# EAGLE schematic RastoBot-r1 (EAGLE 9.6.2)

## Sheet 1 of 11: Inputs
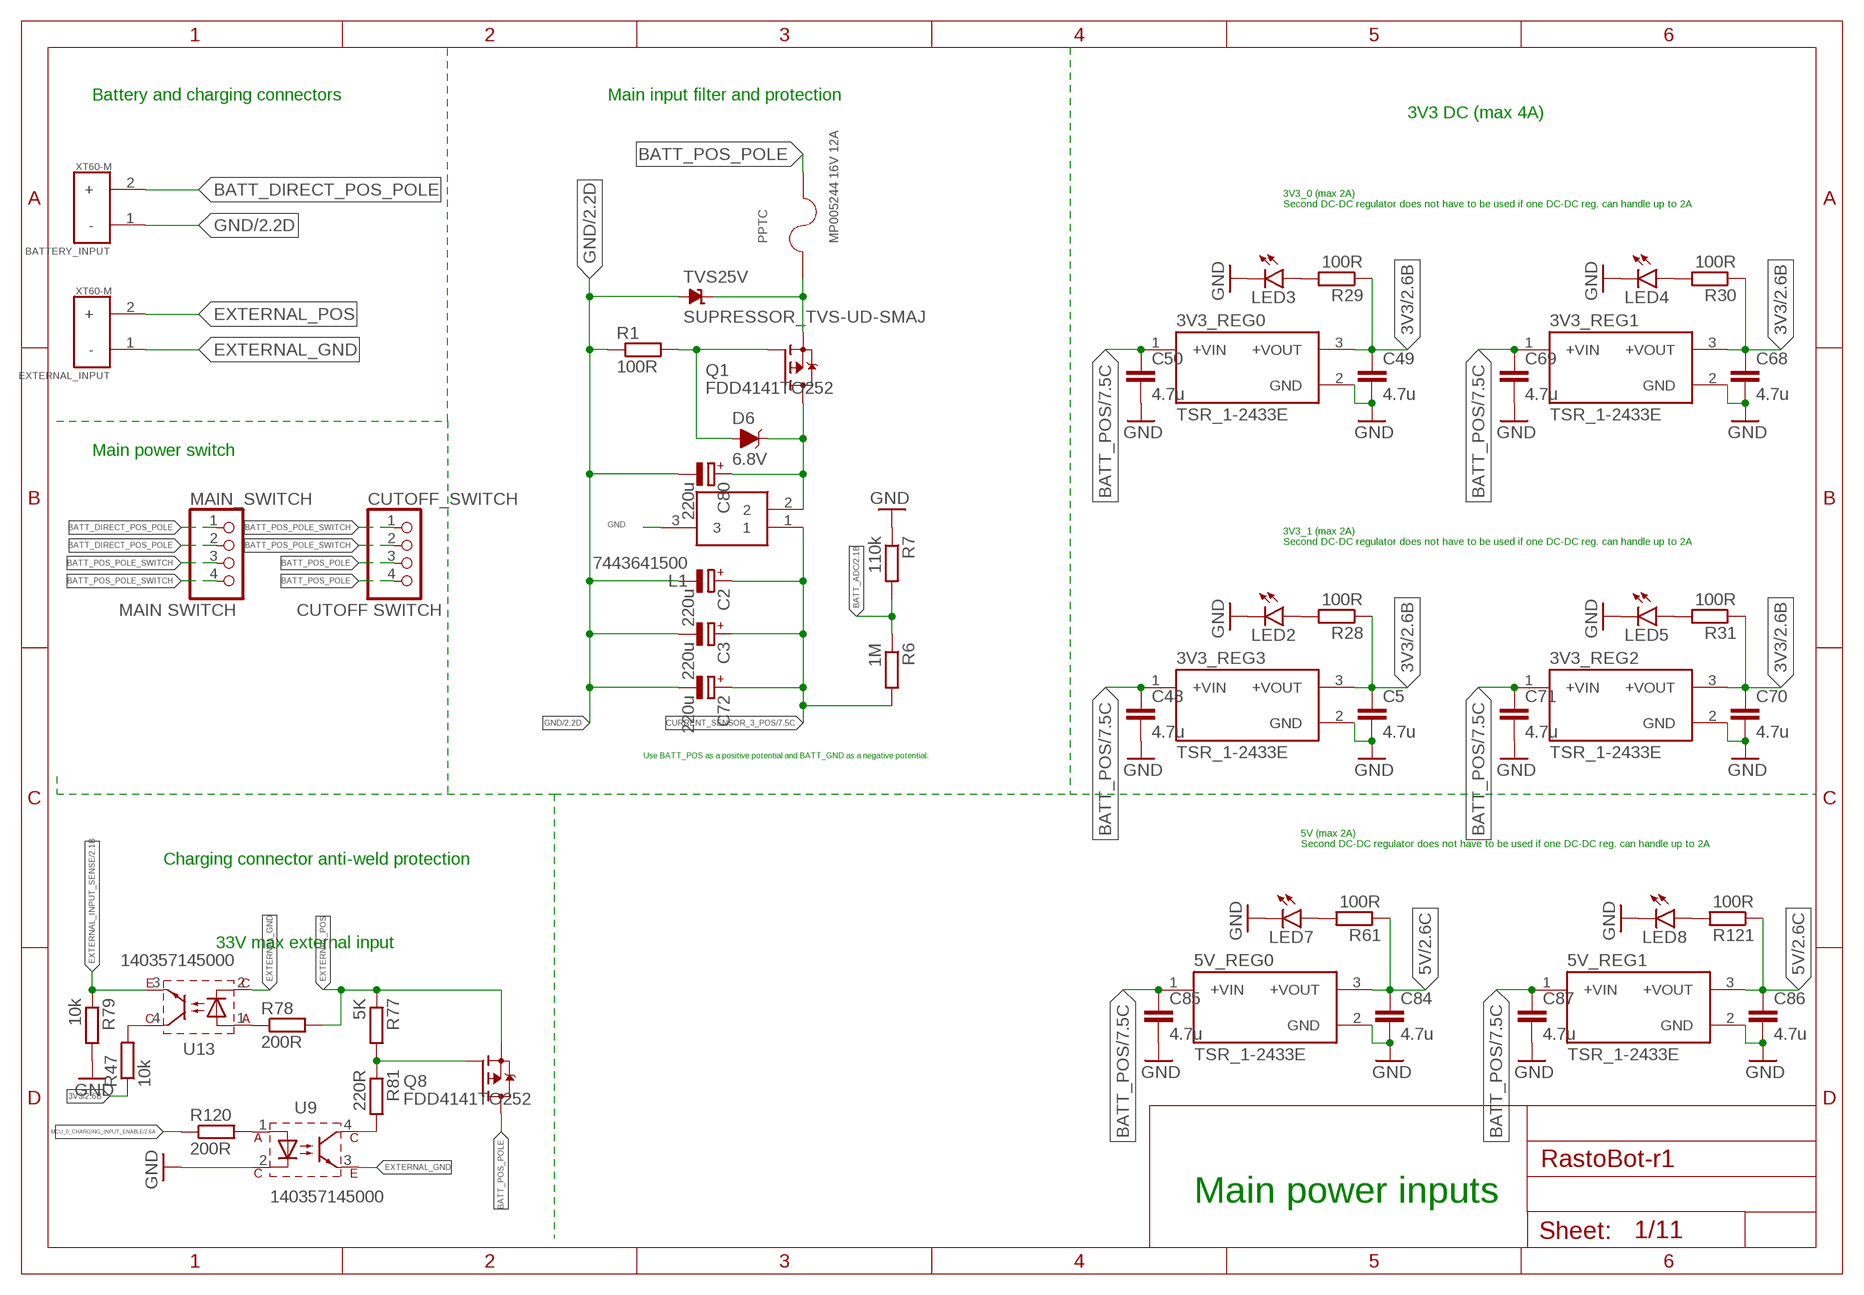
[diagram p0: schematic, sheet 1]

### Parts
3V3_REG0  TSR_1-2433E  [CONV_TSR_1-2433E]
3V3_REG1  TSR_1-2433E  [CONV_TSR_1-2433E]
3V3_REG2  TSR_1-2433E  [CONV_TSR_1-2433E]
3V3_REG3  TSR_1-2433E  [CONV_TSR_1-2433E]
5V_REG0  TSR_1-2433E  [CONV_TSR_1-2433E]
5V_REG1  TSR_1-2433E  [CONV_TSR_1-2433E]
BATTERY_INPUT  XT60-M  [AMASS_XT60-M]
C2  220u  CPOL-EUE2.5-5  [E2,5-5]
C3  220u  CPOL-EUE2.5-5  [E2,5-5]
C5  4.7u  C-EUC1206  [C1206]
C48  4.7u  C-EUC1206  [C1206]
C49  4.7u  C-EUC1206  [C1206]
C50  4.7u  C-EUC1206  [C1206]
C68  4.7u  C-EUC1206  [C1206]
C69  4.7u  C-EUC1206  [C1206]
C70  4.7u  C-EUC1206  [C1206]
C71  4.7u  C-EUC1206  [C1206]
C72  220u  CPOL-EUE2.5-5  [E2,5-5]
C80  220u  CPOL-EUE2.5-5  [E2,5-5]
C84  4.7u  C-EUC1206  [C1206]
C85  4.7u  C-EUC1206  [C1206]
C86  4.7u  C-EUC1206  [C1206]
C87  4.7u  C-EUC1206  [C1206]
CUTOFF_SWITCH  CUTOFF SWITCH  PINHD-1X4  [1X04]
D6  6.8V  DIODE-ZENER-BZT52C3V6S  [SOD-323]
EXTERNAL_INPUT  XT60-M  [AMASS_XT60-M]
L1  7443641500  [74436413300]
LED2  LEDSML0805  [SML0805]
LED3  LEDSML0805  [SML0805]
LED4  LEDSML0805  [SML0805]
LED5  LEDSML0805  [SML0805]
LED7  LEDSML0805  [SML0805]
LED8  LEDSML0805  [SML0805]
MAIN_SWITCH  MAIN SWITCH  PINHD-1X4  [1X04]
PPTC  MP005244 16V 12A  0ZCF0075AF2C  [FUSE_0ZCF0075AF2C]
Q1  FDD4141TO252  [TO252]
Q8  FDD4141TO252  [TO252]
R1  100R  R-EU_R0805  [R0805]
R6  1M  R-EU_R0805  [R0805]
R7  110k  R-EU_R0805  [R0805]
R28  100R  R-EU_R0603  [R0603]
R29  100R  R-EU_R0603  [R0603]
R30  100R  R-EU_R0603  [R0603]
R31  100R  R-EU_R0603  [R0603]
R47  10k  R-EU_R0805  [R0805]
R61  100R  R-EU_R0603  [R0603]
R77  5K  R-EU_R0805  [R0805]
R78  200R  R-EU_R0805  [R0805]
R79  10k  R-EU_R0805  [R0805]
R81  220R  R-EU_R0805  [R0805]
R120  200R  R-EU_R0805  [R0805]
R121  100R  R-EU_R0603  [R0603]
TVS25V  SUPRESSOR_TVS-UD-SMAJ  [SUPRESSOR_SMAJ]
U9  140357145000  WL-OCPT_SERIES_357_140357145000  [WL-OCPT_SOP4]
U13  140357145000  WL-OCPT_SERIES_357_140357145000  [WL-OCPT_SOP4]

### Nets
3V3: 3V3_REG0.3(+VOUT) 3V3_REG1.3(+VOUT) 3V3_REG2.3(+VOUT) 3V3_REG3.3(+VOUT) C5.1 C49.1 C68.1 C70.1 R28.1 R29.1 R30.1 R31.1 R47.1 ; also sheet 2,3,4,5,6,7,8,10,11
5V: 5V_REG0.3(+VOUT) 5V_REG1.3(+VOUT) C84.1 C86.1 R61.1 R121.1 ; also sheet 2,5,10,11
BATT_ADC: R6.1 R7.2 ; also sheet 2
BATT_DIRECT_POS_POLE: BATTERY_INPUT.2(+) MAIN_SWITCH.1 MAIN_SWITCH.2 ; also sheet 11
BATT_POS: 3V3_REG0.1(+VIN) 3V3_REG1.1(+VIN) 3V3_REG2.1(+VIN) 3V3_REG3.1(+VIN) 5V_REG0.1(+VIN) 5V_REG1.1(+VIN) C48.1 C50.1 C69.1 C71.1 C85.1 C87.1 ; also sheet 7,8,9,10,11
BATT_POS_POLE: CUTOFF_SWITCH.3 CUTOFF_SWITCH.4 PPTC.2 Q8.3(D)
BATT_POS_POLE_SWITCH: CUTOFF_SWITCH.1 CUTOFF_SWITCH.2 MAIN_SWITCH.3 MAIN_SWITCH.4
CURRENT_SENSOR_3_POS: C2.+ C3.+ C72.+ L1.1 R6.2 ; also sheet 7
EXTERNAL_GND: EXTERNAL_INPUT.1(-) U9.3 U13.2
EXTERNAL_INPUT_SENSE: R79.1 U13.3 ; also sheet 2
EXTERNAL_POS: EXTERNAL_INPUT.2(+) Q8.2(S) R77.1 R78.2
GND: 3V3_REG0.2(GND) 3V3_REG1.2(GND) 3V3_REG2.2(GND) 3V3_REG3.2(GND) 5V_REG0.2(GND) 5V_REG1.2(GND) BATTERY_INPUT.1(-) C2.- C3.- C5.2 C48.2 C49.2 C50.2 C68.2 C69.2 C70.2 C71.2 C72.- C80.- C84.2 C85.2 C86.2 C87.2 L1.3 LED2.C LED3.C LED4.C LED5.C LED7.C LED8.C R1.1 R7.1 R79.2 TVS25V.A U9.2 ; also sheet 2,3,4,5,6,7,8,9,10
MCU_0_CHARGING_INPUT_ENABLE: R120.1 ; also sheet 2
N$1: D6.A Q1.1(G) R1.2
N$2: C80.+ D6.C L1.2 Q1.3(D)
N$3: PPTC.1 Q1.2(S) TVS25V.C
N$30: LED2.A R28.2
N$57: LED3.A R29.2
N$58: LED4.A R30.2
N$59: LED5.A R31.2
N$83: R120.2 U9.1
N$84: Q8.1(G) R77.2 R81.1
N$85: R81.2 U9.4
N$87: R47.2 U13.4
N$120: LED7.A R61.2
N$121: LED8.A R121.2
N$122: R78.1 U13.1

### Notes on the sheet
- Battery and charging connectors | Main input filter and protection
- 3V3 DC (max 4A)
- 3V3_0 (max 2A)
  Second DC-DC regulator does not have to be used if one DC-DC reg. can handle up to 2A
- Main power switch
- 3V3_1 (max 2A)
  Second DC-DC regulator does not have to be used if one DC-DC reg. can handle up to 2A
- Use BATT_POS as a positive potential and BATT_GND as a negative potential.
- 5V (max 2A)
  Second DC-DC regulator does not have to be used if one DC-DC reg. can handle up to 2A
- Charging connector anti-weld protection
- 33V max external input
- Main power inputs

## Sheet 2 of 11: MCU_0 PIC18 Sensors
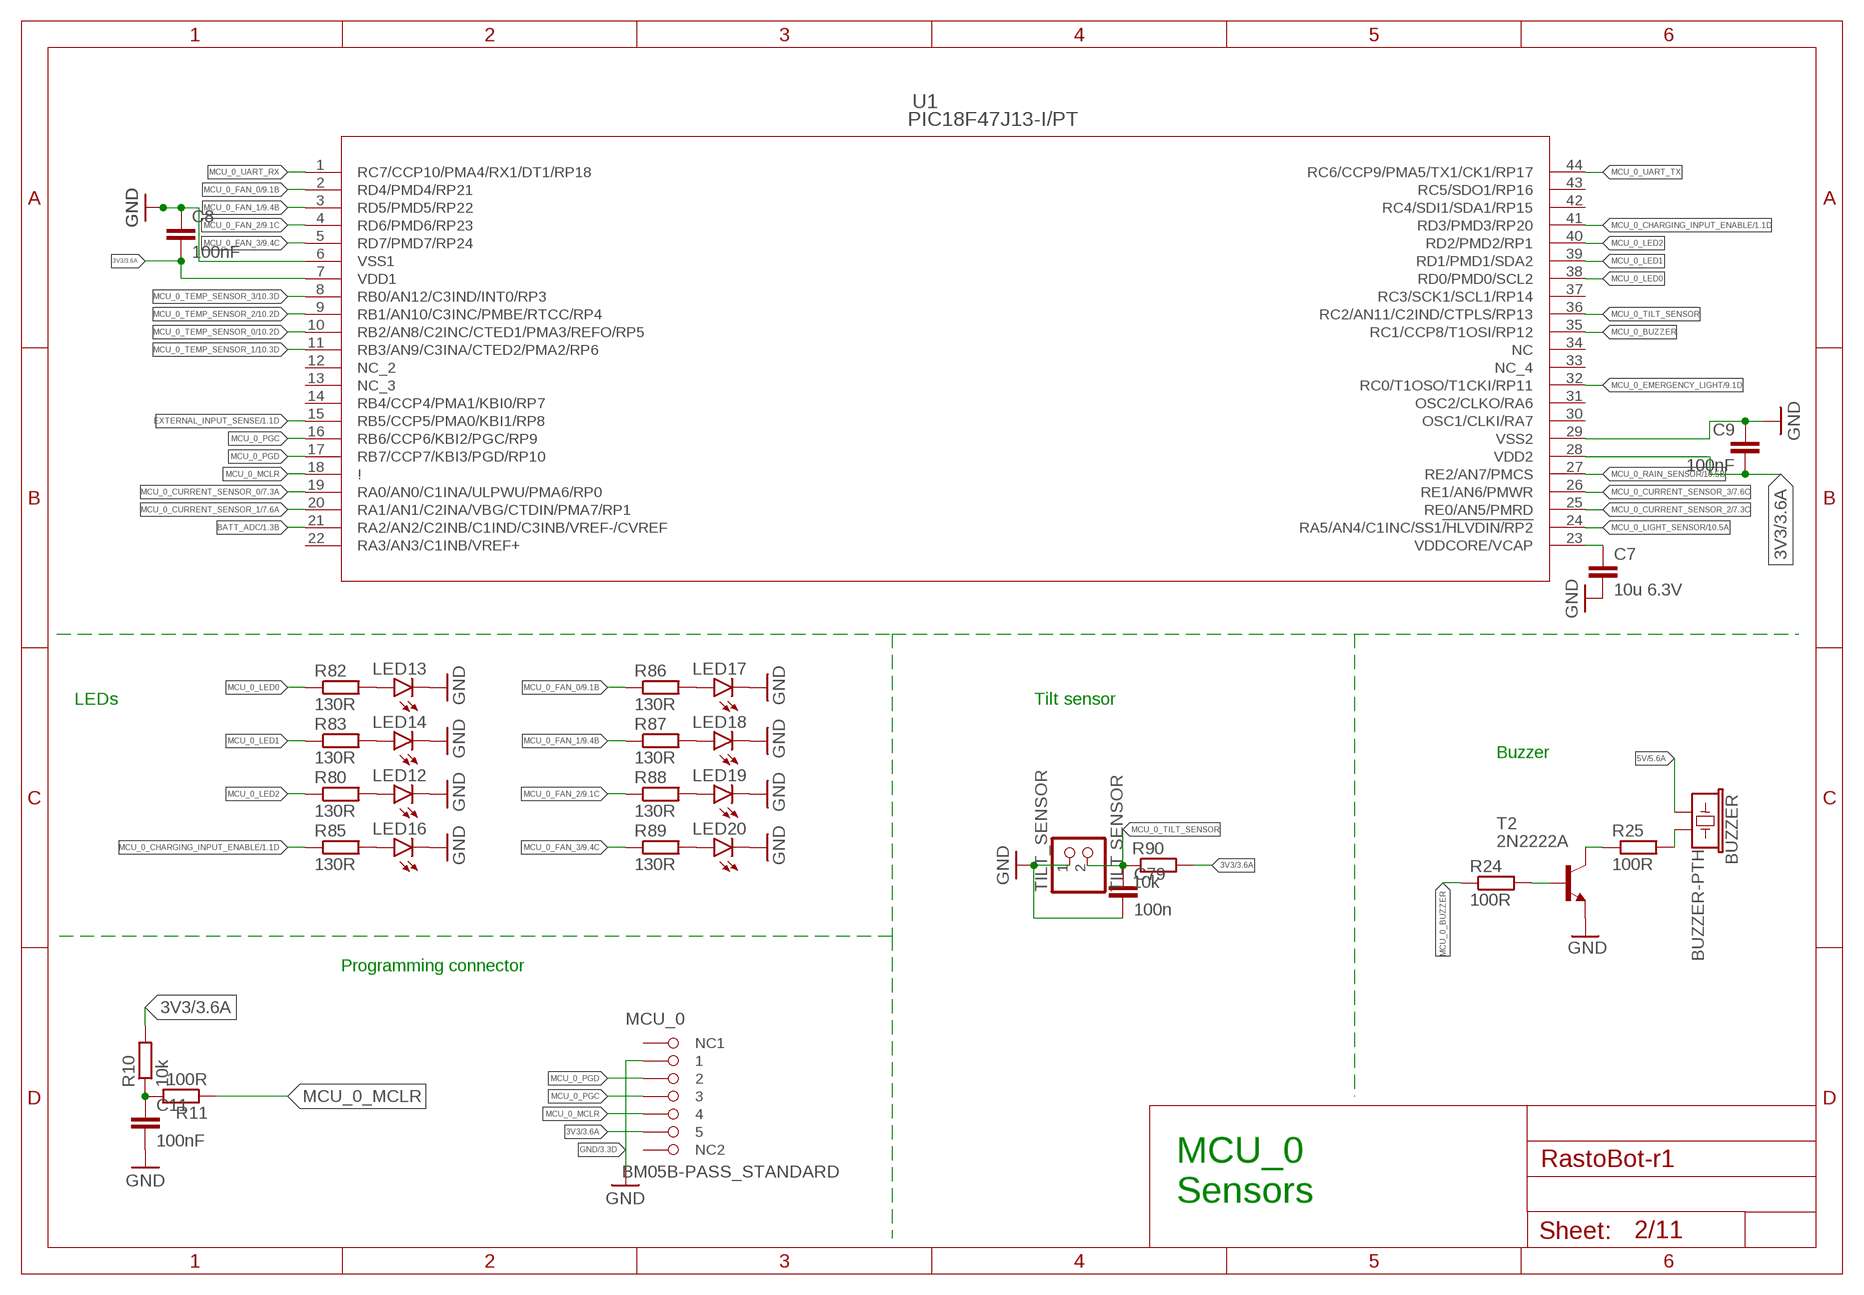
[diagram p1: schematic, sheet 2]

### Parts
BUZZER  BUZZER-PTH  [BUZZER-12MM]
C7  10u 6.3V  C-EUC1206  [C1206]
C8  100nF  C-EUC0603  [C0603]
C9  100nF  C-EUC0603  [C0603]
C11  100nF  C-EUC0603  [C0603]
C79  100n  C-EUC1206  [C1206]
LED12  LEDSML0805  [SML0805]
LED13  LEDSML0805  [SML0805]
LED14  LEDSML0805  [SML0805]
LED16  LEDSML0805  [SML0805]
LED17  LEDSML0805  [SML0805]
LED18  LEDSML0805  [SML0805]
LED19  LEDSML0805  [SML0805]
LED20  LEDSML0805  [SML0805]
MCU_0  BM05B-PASS_STANDARD  [BM05B-PASS]
R10  10k  R-EU_R0805  [R0805]
R11  100R  R-EU_R0805  [R0805]
R24  100R  R-EU_R0805  [R0805]
R25  100R  R-EU_R0805  [R0805]
R80  130R  R-EU_R0603  [R0603]
R82  130R  R-EU_R0603  [R0603]
R83  130R  R-EU_R0603  [R0603]
R85  130R  R-EU_R0603  [R0603]
R86  130R  R-EU_R0603  [R0603]
R87  130R  R-EU_R0603  [R0603]
R88  130R  R-EU_R0603  [R0603]
R89  130R  R-EU_R0603  [R0603]
R90  10k  R-EU_R0603  [R0603]
T2  2N2222A  BC547-NPN-TO92-CBE  [TO92-CBE]
TILT_SENSOR  TILT SENSOR  PINHD-1X2  [1X02]
U1  PIC18F47J13-I/PT  [TQFP44_10X10MC_MCH]

### Nets
3V3: C8.2 C9.2 MCU_0.P$5 R10.2 R90.2 U1.7(VDD1) U1.28(VDD2) ; also sheet 1,3,4,5,6,7,8,10,11
5V: BUZZER.+ ; also sheet 1,5,10,11
BATT_ADC: U1.21(RA2/AN2/C2INB/C1IND/C3INB/VREF-/CVREF) ; also sheet 1
EXTERNAL_INPUT_SENSE: U1.15(RB5/CCP5/PMA0/KBI1/RP8) ; also sheet 1
GND: C7.2 C8.1 C9.1 C11.2 C79.2 LED12.C LED13.C LED14.C LED16.C LED17.C LED18.C LED19.C LED20.C MCU_0.P$1 T2.E TILT_SENSOR.1 U1.6(VSS1) U1.29(VSS2) ; also sheet 1,3,4,5,6,7,8,9,10
MCU_0_BUZZER: R24.1 U1.35(RC1/CCP8/T1OSI/RP12)
MCU_0_CHARGING_INPUT_ENABLE: R85.1 U1.41(RD3/PMD3/RP20) ; also sheet 1
MCU_0_CURRENT_SENSOR_0: U1.19(RA0/AN0/C1INA/ULPWU/PMA6/RP0) ; also sheet 7,11
MCU_0_CURRENT_SENSOR_1: U1.20(RA1/AN1/C2INA/VBG/CTDIN/PMA7/RP1) ; also sheet 7,11
MCU_0_CURRENT_SENSOR_2: U1.25(RE0/AN5/PMRD) ; also sheet 7,11
MCU_0_CURRENT_SENSOR_3: U1.26(RE1/AN6/PMWR) ; also sheet 7,11
MCU_0_EMERGENCY_LIGHT: U1.32(RC0/T1OSO/T1CKI/RP11) ; also sheet 9
MCU_0_FAN_0: R86.1 U1.2(RD4/PMD4/RP21) ; also sheet 9
MCU_0_FAN_1: R87.1 U1.3(RD5/PMD5/RP22) ; also sheet 9
MCU_0_FAN_2: R88.1 U1.4(RD6/PMD6/RP23) ; also sheet 9
MCU_0_FAN_3: R89.1 U1.5(RD7/PMD7/RP24) ; also sheet 9
MCU_0_LED0: R82.1 U1.38(RD0/PMD0/SCL2)
MCU_0_LED1: R83.1 U1.39(RD1/PMD1/SDA2)
MCU_0_LED2: R80.1 U1.40(RD2/PMD2/RP1)
MCU_0_LIGHT_SENSOR: U1.24(RA5/AN4/C1INC/SS1!/HLVDIN/RP2) ; also sheet 10
MCU_0_MCLR: MCU_0.P$4 R11.1 U1.18(!)
MCU_0_PGC: MCU_0.P$3 U1.16(RB6/CCP6/KBI2/PGC/RP9)
MCU_0_PGD: MCU_0.P$2 U1.17(RB7/CCP7/KBI3/PGD/RP10)
MCU_0_RAIN_SENSOR: U1.27(RE2/AN7/PMCS) ; also sheet 10
MCU_0_TEMP_SENSOR_0: U1.10(RB2/AN8/C2INC/CTED1/PMA3/REFO/RP5) ; also sheet 10
MCU_0_TEMP_SENSOR_1: U1.11(RB3/AN9/C3INA/CTED2/PMA2/RP6) ; also sheet 10
MCU_0_TEMP_SENSOR_2: U1.9(RB1/AN10/C3INC/PMBE/RTCC/RP4) ; also sheet 10
MCU_0_TEMP_SENSOR_3: U1.8(RB0/AN12/C3IND/INT0/RP3) ; also sheet 10
MCU_0_TILT_SENSOR: C79.1 R90.1 TILT_SENSOR.2 U1.36(RC2/AN11/C2IND/CTPLS/RP13) ; also sheet 11
MCU_0_UART_RX: U1.1(RC7/CCP10/PMA4/RX1/DT1/RP18) ; also sheet 4,11
MCU_0_UART_TX: U1.44(RC6/CCP9/PMA5/TX1/CK1/RP17) ; also sheet 4,11
N$11: C7.1 U1.23(VDDCORE/VCAP)
N$14: C11.1 R10.1 R11.2
N$24: R24.2 T2.B
N$28: BUZZER.- R25.2
N$61: R25.1 T2.C
N$88: LED12.A R80.2
N$89: LED13.A R82.2
N$90: LED14.A R83.2
N$92: LED16.A R85.2
N$93: LED17.A R86.2
N$94: LED18.A R87.2
N$95: LED19.A R88.2
N$96: LED20.A R89.2
Unconnected: MCU_0.A(NC1) MCU_0.B(NC2) U1.12(NC_2) U1.13(NC_3) U1.14(RB4/CCP4/PMA1/KBI0/RP7) U1.22(RA3/AN3/C1INB/VREF+) U1.30(OSC1/CLKI/RA7) U1.31(OSC2/CLKO/RA6) U1.33(NC_4) U1.34(NC) U1.37(RC3/SCK1/SCL1/RP14) U1.42(RC4/SDI1/SDA1/RP15) U1.43(RC5/SDO1/RP16)

### Notes on the sheet
- LEDs | Tilt sensor
- Buzzer
- Programming connector
- MCU_0
  Sensors

## Sheet 3 of 11: MCU_1 PIC32MM Motor Driving
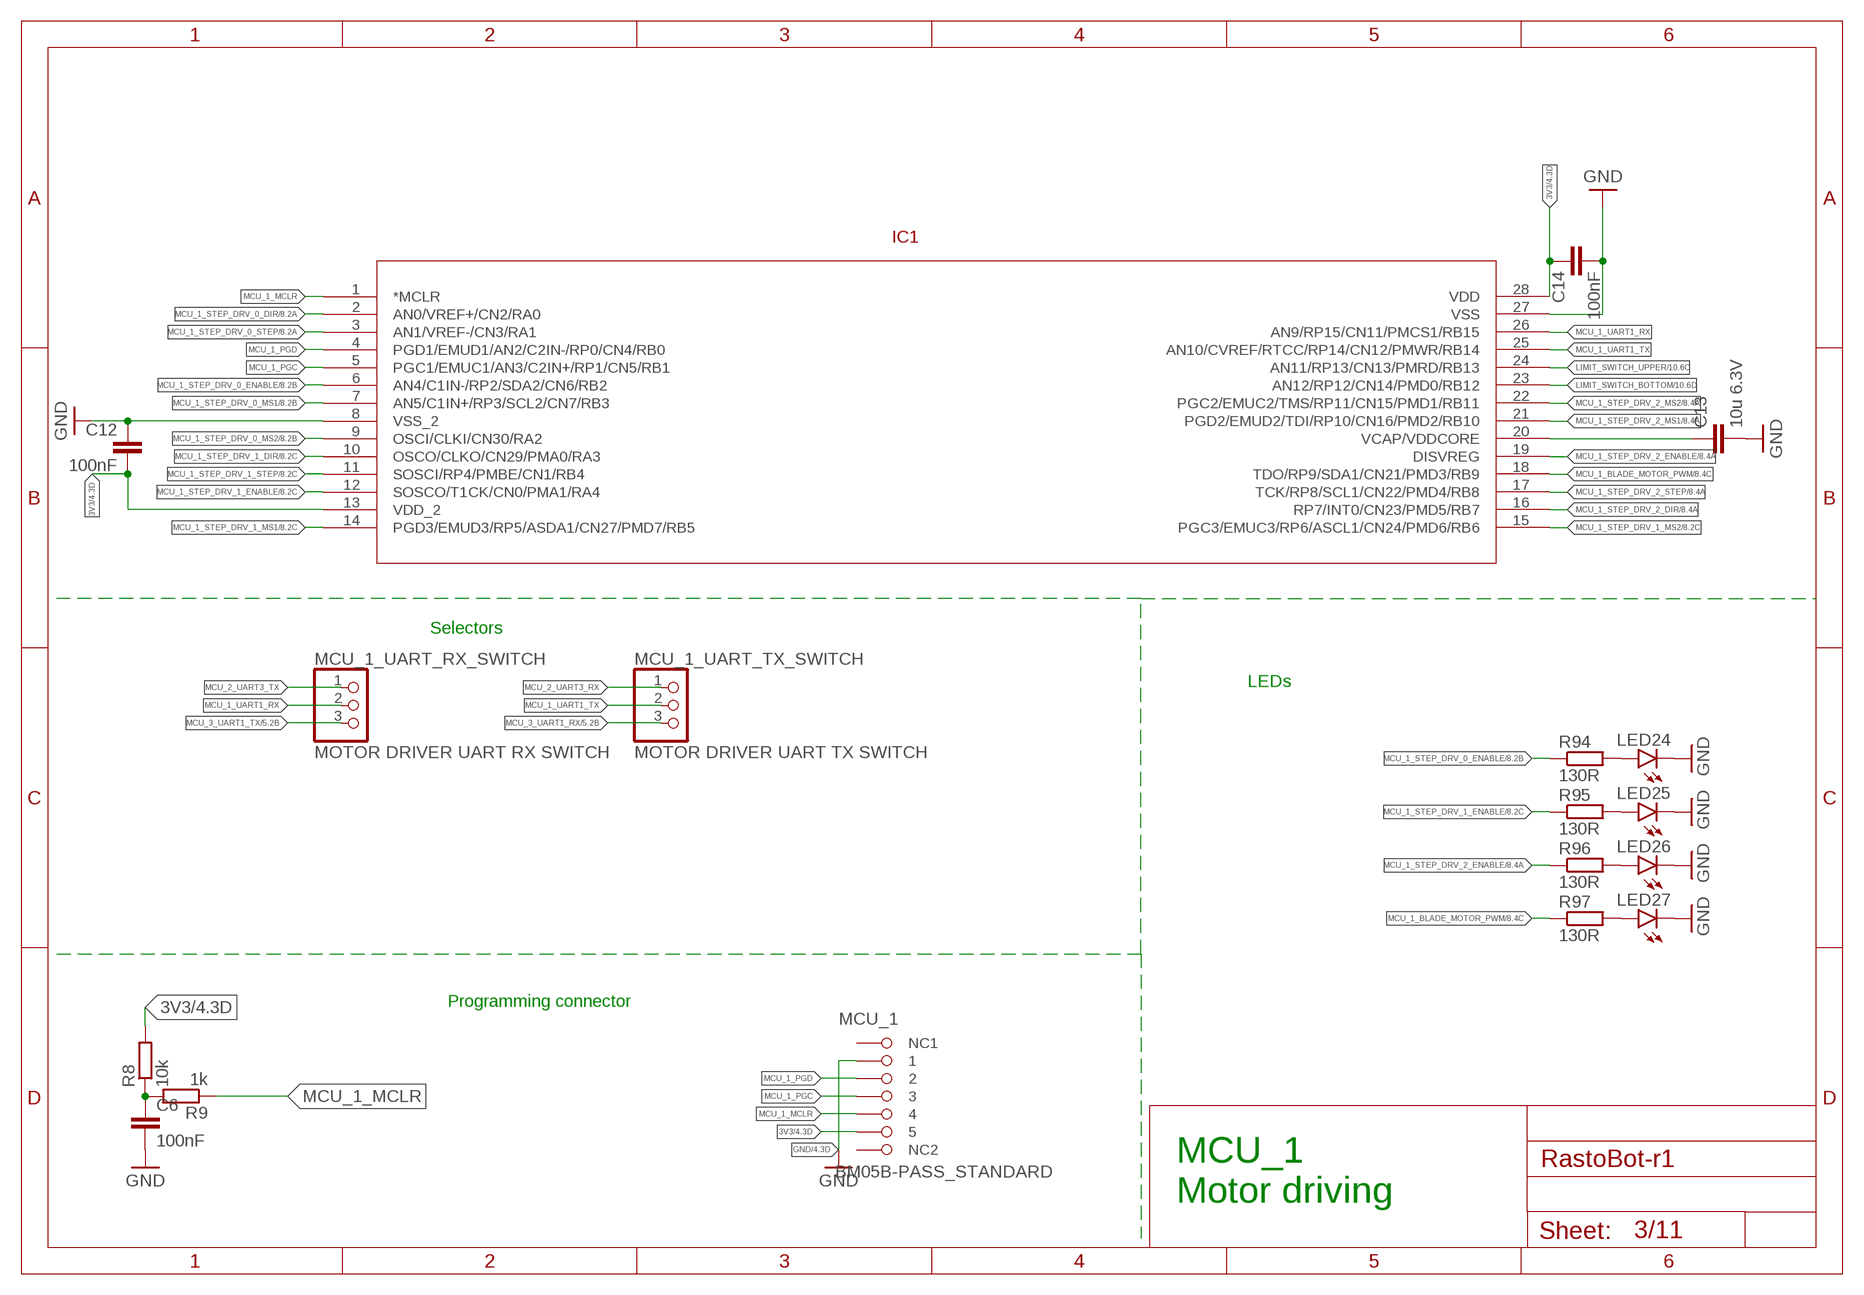
[diagram p2: schematic, sheet 3]

### Parts
C6  100nF  C-EUC0603  [C0603]
C12  100nF  C-EUC0603  [C0603]
C13  10u 6.3V  C-EUC1206  [C1206]
C14  100nF  C-EUC0603  [C0603]
IC1  PIC24FJ32GA002-X  [SPDIP28_300MC]
LED24  LEDSML0805  [SML0805]
LED25  LEDSML0805  [SML0805]
LED26  LEDSML0805  [SML0805]
LED27  LEDSML0805  [SML0805]
MCU_1  BM05B-PASS_STANDARD  [BM05B-PASS]
MCU_1_UART_RX_SWITCH  MOTOR DRIVER UART RX SWITCH  PINHD-1X3  [1X03]
MCU_1_UART_TX_SWITCH  MOTOR DRIVER UART TX SWITCH  PINHD-1X3  [1X03]
R8  10k  R-EU_R0805  [R0805]
R9  1k  R-EU_R0805  [R0805]
R94  130R  R-EU_R0603  [R0603]
R95  130R  R-EU_R0603  [R0603]
R96  130R  R-EU_R0603  [R0603]
R97  130R  R-EU_R0603  [R0603]

### Nets
3V3: C12.2 C14.1 IC1.13(VDD_2) IC1.28(VDD) MCU_1.P$5 R8.2 ; also sheet 1,2,4,5,6,7,8,10,11
GND: C6.2 C12.1 C13.2 C14.2 IC1.8(VSS_2) IC1.27(VSS) LED24.C LED25.C LED26.C LED27.C MCU_1.P$1 ; also sheet 1,2,4,5,6,7,8,9,10
LIMIT_SWITCH_BOTTOM: IC1.23(AN12/RP12/CN14/PMD0/RB12) ; also sheet 10
LIMIT_SWITCH_UPPER: IC1.24(AN11/RP13/CN13/PMRD/RB13) ; also sheet 10
MCU_1_BLADE_MOTOR_PWM: IC1.18(TDO/RP9/SDA1/CN21/PMD3/RB9) R97.1 ; also sheet 8
MCU_1_MCLR: IC1.1(*MCLR) MCU_1.P$4 R9.1
MCU_1_PGC: IC1.5(PGC1/EMUC1/AN3/C2IN+/RP1/CN5/RB1) MCU_1.P$3
MCU_1_PGD: IC1.4(PGD1/EMUD1/AN2/C2IN-/RP0/CN4/RB0) MCU_1.P$2
MCU_1_STEP_DRV_0_DIR: IC1.2(AN0/VREF+/CN2/RA0) ; also sheet 8
MCU_1_STEP_DRV_0_ENABLE: IC1.6(AN4/C1IN-/RP2/SDA2/CN6/RB2) R94.1 ; also sheet 8
MCU_1_STEP_DRV_0_MS1: IC1.7(AN5/C1IN+/RP3/SCL2/CN7/RB3) ; also sheet 8
MCU_1_STEP_DRV_0_MS2: IC1.9(OSCI/CLKI/CN30/RA2) ; also sheet 8
MCU_1_STEP_DRV_0_STEP: IC1.3(AN1/VREF-/CN3/RA1) ; also sheet 8
MCU_1_STEP_DRV_1_DIR: IC1.10(OSCO/CLKO/CN29/PMA0/RA3) ; also sheet 8
MCU_1_STEP_DRV_1_ENABLE: IC1.12(SOSCO/T1CK/CN0/PMA1/RA4) R95.1 ; also sheet 8
MCU_1_STEP_DRV_1_MS1: IC1.14(PGD3/EMUD3/RP5/ASDA1/CN27/PMD7/RB5) ; also sheet 8
MCU_1_STEP_DRV_1_MS2: IC1.15(PGC3/EMUC3/RP6/ASCL1/CN24/PMD6/RB6) ; also sheet 8
MCU_1_STEP_DRV_1_STEP: IC1.11(SOSCI/RP4/PMBE/CN1/RB4) ; also sheet 8
MCU_1_STEP_DRV_2_DIR: IC1.16(RP7/INT0/CN23/PMD5/RB7) ; also sheet 8
MCU_1_STEP_DRV_2_ENABLE: IC1.19(DISVREG) R96.1 ; also sheet 8
MCU_1_STEP_DRV_2_MS1: IC1.21(PGD2/EMUD2/TDI/RP10/CN16/PMD2/RB10) ; also sheet 8
MCU_1_STEP_DRV_2_MS2: IC1.22(PGC2/EMUC2/TMS/RP11/CN15/PMD1/RB11) ; also sheet 8
MCU_1_STEP_DRV_2_STEP: IC1.17(TCK/RP8/SCL1/CN22/PMD4/RB8) ; also sheet 8
MCU_1_UART1_RX: IC1.26(AN9/RP15/CN11/PMCS1/RB15) MCU_1_UART_RX_SWITCH.2 ; also sheet 11
MCU_1_UART1_TX: IC1.25(AN10/CVREF/RTCC/RP14/CN12/PMWR/RB14) MCU_1_UART_TX_SWITCH.2 ; also sheet 11
MCU_2_UART3_RX: MCU_1_UART_TX_SWITCH.1 ; also sheet 4
MCU_2_UART3_TX: MCU_1_UART_RX_SWITCH.1 ; also sheet 4
MCU_3_UART1_RX: MCU_1_UART_TX_SWITCH.3 ; also sheet 5,11
MCU_3_UART1_TX: MCU_1_UART_RX_SWITCH.3 ; also sheet 5,11
N$9: C6.1 R8.1 R9.2
N$10: C13.1 IC1.20(VCAP/VDDCORE)
N$100: LED24.A R94.2
N$101: LED25.A R95.2
N$102: LED26.A R96.2
N$103: LED27.A R97.2
Unconnected: MCU_1.A(NC1) MCU_1.B(NC2)

### Notes on the sheet
- Selectors
- LEDs
- Programming connector
- MCU_1
  Motor driving

## Sheet 4 of 11: MCU_2 PIC32MX Navigation
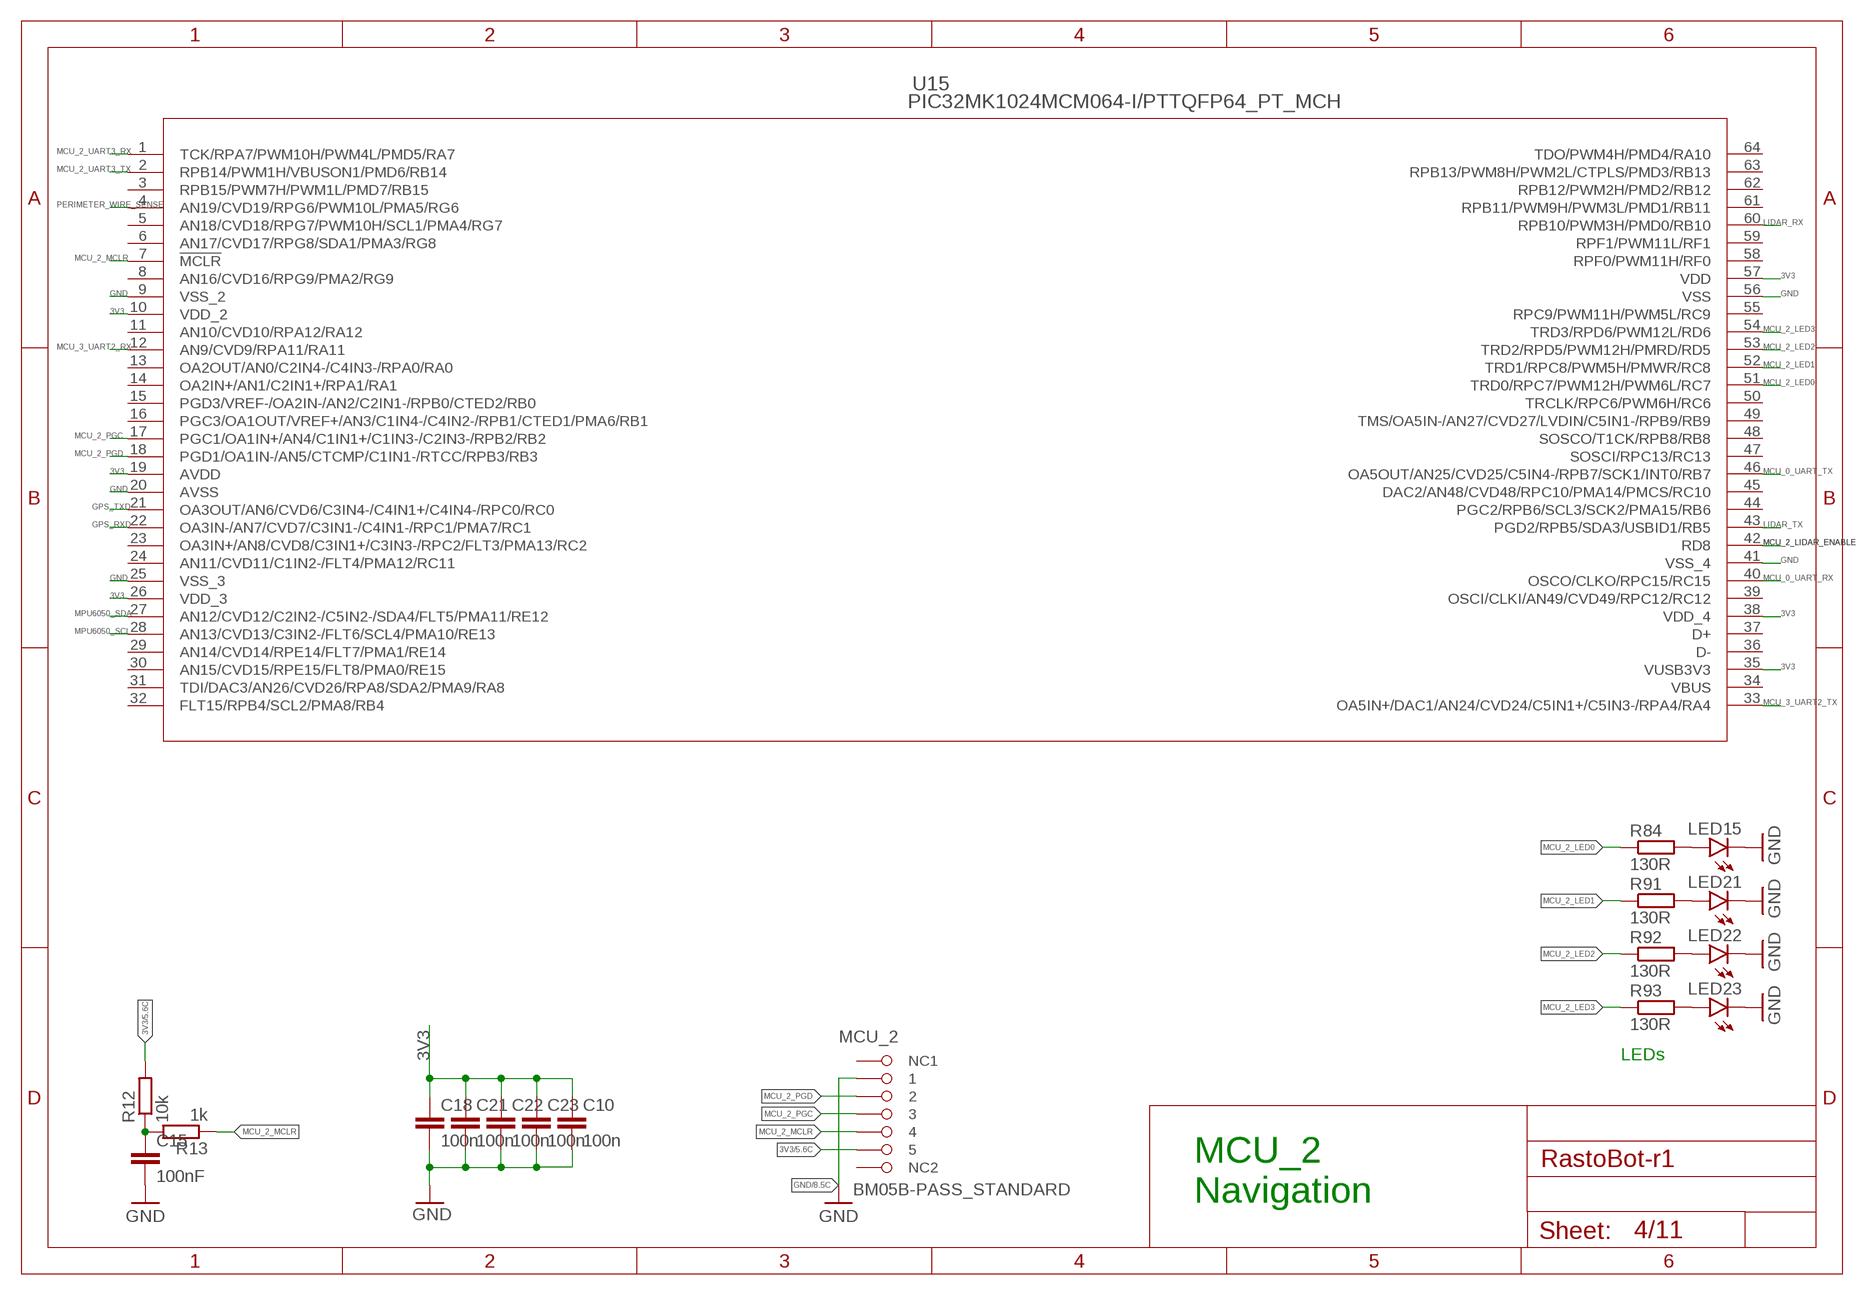
[diagram p3: schematic, sheet 4]

### Parts
C10  100n  C-EUC0603  [C0603]
C15  100nF  C-EUC0603  [C0603]
C18  100n  C-EUC0603  [C0603]
C21  100n  C-EUC0603  [C0603]
C22  100n  C-EUC0603  [C0603]
C23  100n  C-EUC0603  [C0603]
LED15  LEDSML0805  [SML0805]
LED21  LEDSML0805  [SML0805]
LED22  LEDSML0805  [SML0805]
LED23  LEDSML0805  [SML0805]
MCU_2  BM05B-PASS_STANDARD  [BM05B-PASS]
R12  10k  R-EU_R0805  [R0805]
R13  1k  R-EU_R0805  [R0805]
R84  130R  R-EU_R0603  [R0603]
R91  130R  R-EU_R0603  [R0603]
R92  130R  R-EU_R0603  [R0603]
R93  130R  R-EU_R0603  [R0603]
U15  PIC32MK1024MCM064-I/PTTQFP64_PT_MCH  [TQFP64_PT_MCH]

### Nets
3V3: C10.1 C18.1 C21.1 C22.1 C23.1 MCU_2.P$5 R12.2 U15.10(VDD_2) U15.19(AVDD) U15.26(VDD_3) U15.35(VUSB3V3) U15.38(VDD_4) U15.57(VDD) ; also sheet 1,2,3,5,6,7,8,10,11
GND: C10.2 C15.2 C18.2 C21.2 C22.2 C23.2 LED15.C LED21.C LED22.C LED23.C MCU_2.P$1 U15.9(VSS_2) U15.20(AVSS) U15.25(VSS_3) U15.41(VSS_4) U15.56(VSS) ; also sheet 1,2,3,5,6,7,8,9,10
GPS_RXD: U15.22(OA3IN-/AN7/CVD7/C3IN1-/C4IN1-/RPC1/PMA7/RC1) ; also sheet 10,11
GPS_TXD: U15.21(OA3OUT/AN6/CVD6/C3IN4-/C4IN1+/C4IN4-/RPC0/RC0) ; also sheet 10,11
LIDAR_RX: U15.60(RPB10/PWM3H/PMD0/RB10) ; also sheet 10,11
LIDAR_TX: U15.43(PGD2/RPB5/SDA3/USBID1/RB5) ; also sheet 10,11
MCU_0_UART_RX: U15.40(OSCO/CLKO/RPC15/RC15) ; also sheet 2,11
MCU_0_UART_TX: U15.46(OA5OUT/AN25/CVD25/C5IN4-/RPB7/SCK1/INT0/RB7) ; also sheet 2,11
MCU_2_LED0: R84.1 U15.51(TRD0/RPC7/PWM12H/PWM6L/RC7)
MCU_2_LED1: R91.1 U15.52(TRD1/RPC8/PWM5H/PMWR/RC8)
MCU_2_LED2: R92.1 U15.53(TRD2/RPD5/PWM12H/PMRD/RD5)
MCU_2_LED3: R93.1 U15.54(TRD3/RPD6/PWM12L/RD6)
MCU_2_LIDAR_ENABLE: U15.42(RD8) ; also sheet 10
MCU_2_MCLR: MCU_2.P$4 R13.1 U15.7(!MCLR)
MCU_2_PGC: MCU_2.P$3 U15.17(PGC1/OA1IN+/AN4/C1IN1+/C1IN3-/C2IN3-/RPB2/RB2)
MCU_2_PGD: MCU_2.P$2 U15.18(PGD1/OA1IN-/AN5/CTCMP/C1IN1-/RTCC/RPB3/RB3)
MCU_2_UART3_RX: U15.1(TCK/RPA7/PWM10H/PWM4L/PMD5/RA7) ; also sheet 3
MCU_2_UART3_TX: U15.2(RPB14/PWM1H/VBUSON1/PMD6/RB14) ; also sheet 3
MCU_3_UART2_RX: U15.12(AN9/CVD9/RPA11/RA11) ; also sheet 5,10
MCU_3_UART2_TX: U15.33(OA5IN+/DAC1/AN24/CVD24/C5IN1+/C5IN3-/RPA4/RA4) ; also sheet 5,10
MPU6050_SCL: U15.28(AN13/CVD13/C3IN2-/FLT6/SCL4/PMA10/RE13) ; also sheet 6,11
MPU6050_SDA: U15.27(AN12/CVD12/C2IN2-/C5IN2-/SDA4/FLT5/PMA11/RE12) ; also sheet 6,11
N$15: C15.1 R12.1 R13.2
N$91: LED15.A R84.2
N$97: LED21.A R91.2
N$98: LED22.A R92.2
N$99: LED23.A R93.2
PERIMETER_WIRE_SENSE: U15.4(AN19/CVD19/RPG6/PWM10L/PMA5/RG6) ; also sheet 10,11
Unconnected: MCU_2.A(NC1) MCU_2.B(NC2) U15.3(RPB15/PWM7H/PWM1L/PMD7/RB15) U15.5(AN18/CVD18/RPG7/PWM10H/SCL1/PMA4/RG7) U15.6(AN17/CVD17/RPG8/SDA1/PMA3/RG8) U15.8(AN16/CVD16/RPG9/PMA2/RG9) U15.11(AN10/CVD10/RPA12/RA12) U15.13(OA2OUT/AN0/C2IN4-/C4IN3-/RPA0/RA0) U15.14(OA2IN+/AN1/C2IN1+/RPA1/RA1) U15.15(PGD3/VREF-/OA2IN-/AN2/C2IN1-/RPB0/CTED2/RB0) U15.16(PGC3/OA1OUT/VREF+/AN3/C1IN4-/C4IN2-/RPB1/CTED1/PMA6/RB1) U15.23(OA3IN+/AN8/CVD8/C3IN1+/C3IN3-/RPC2/FLT3/PMA13/RC2) U15.24(AN11/CVD11/C1IN2-/FLT4/PMA12/RC11) U15.29(AN14/CVD14/RPE14/FLT7/PMA1/RE14) U15.30(AN15/CVD15/RPE15/FLT8/PMA0/RE15) U15.31(TDI/DAC3/AN26/CVD26/RPA8/SDA2/PMA9/RA8) U15.32(FLT15/RPB4/SCL2/PMA8/RB4) U15.36(D-) U15.37(D+) U15.39(OSCI/CLKI/AN49/CVD49/RPC12/RC12) U15.44(PGC2/RPB6/SCL3/SCK2/PMA15/RB6) U15.45(DAC2/AN48/CVD48/RPC10/PMA14/PMCS/RC10) U15.47(SOSCI/RPC13/RC13) U15.48(SOSCO/T1CK/RPB8/RB8) U15.49(TMS/OA5IN-/AN27/CVD27/LVDIN/C5IN1-/RPB9/RB9) U15.50(TRCLK/RPC6/PWM6H/RC6) U15.55(RPC9/PWM11H/PWM5L/RC9) U15.58(RPF0/PWM11H/RF0) U15.59(RPF1/PWM11L/RF1) U15.61(RPB11/PWM9H/PWM3L/PMD1/RB11) U15.62(RPB12/PWM2H/PMD2/RB12) U15.63(RPB13/PWM8H/PWM2L/CTPLS/PMD3/RB13) U15.64(TDO/PWM4H/PMD4/RA10)

### Notes on the sheet
- LEDs
- MCU_2
  Navigation

## Sheet 5 of 11: MCU_3 ESP32
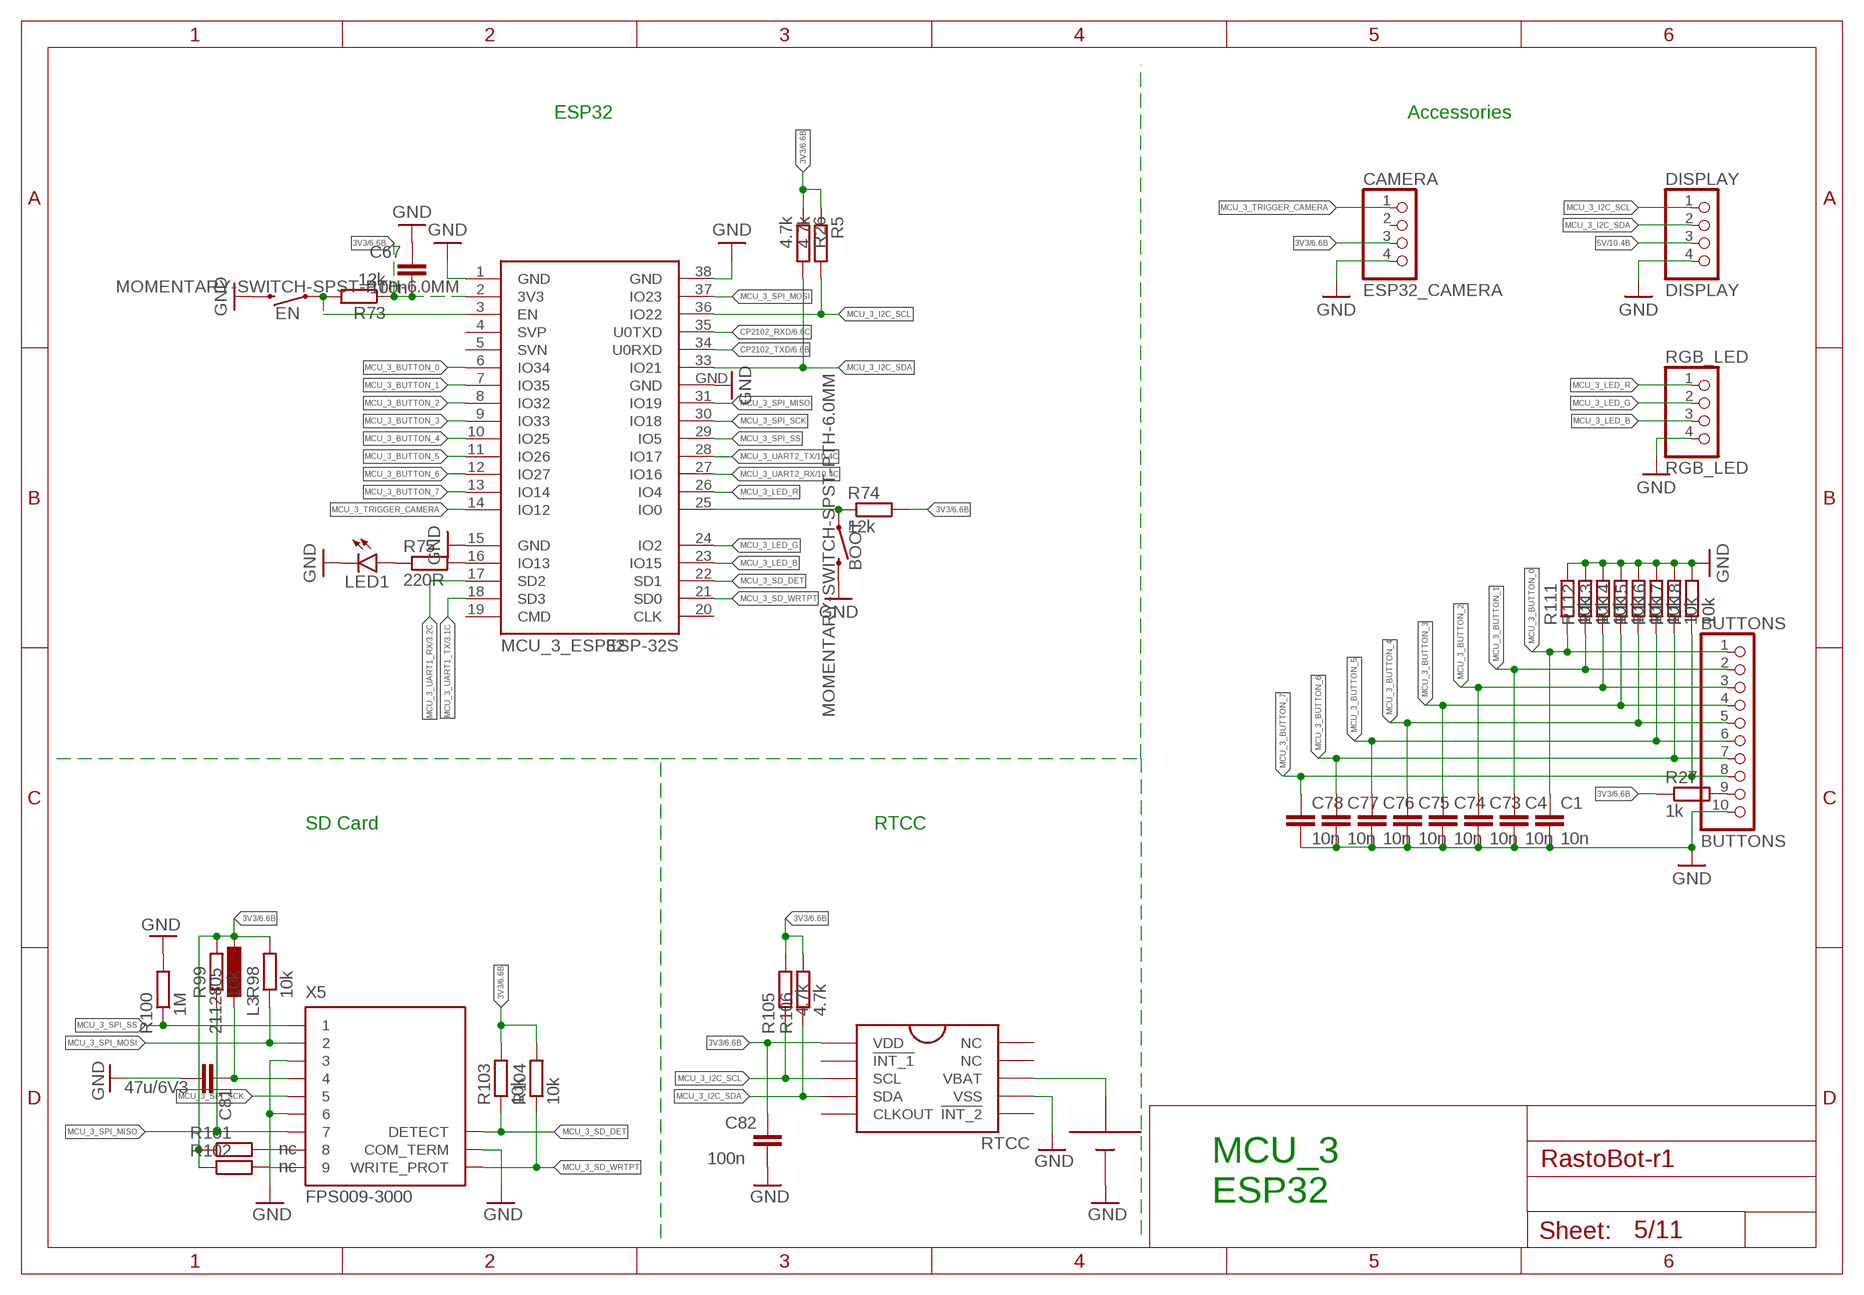
[diagram p4: schematic, sheet 5]

### Parts
BATT1  SMTU2032LF  [SMTU2032LF]
BOOT  MOMENTARY-SWITCH-SPST-PTH-6.0MM  [TACTILE_SWITCH_PTH_6.0MM]
BUTTONS  BUTTONS  PINHD-1X10  [1X10]
C1  10n  C-EUC0603  [C0603]
C4  10n  C-EUC0603  [C0603]
C67  100n  C-EUC0603  [C0603]
C73  10n  C-EUC0603  [C0603]
C74  10n  C-EUC0603  [C0603]
C75  10n  C-EUC0603  [C0603]
C76  10n  C-EUC0603  [C0603]
C77  10n  C-EUC0603  [C0603]
C78  10n  C-EUC0603  [C0603]
C81  47u/6V3  C-EUC1206  [C1206]
C82  100n  C-EUC0603  [C0603]
CAMERA  ESP32_CAMERA  PINHD-1X4  [1X04]
DISPLAY  DISPLAY  PINHD-1X4  [1X04]
EN  MOMENTARY-SWITCH-SPST-PTH-6.0MM  [TACTILE_SWITCH_PTH_6.0MM]
L3  2112805  L-EUL2825P  [L2825P]
LED1  LEDSML0805  [SML0805]
MCU_3_ESP32  ESP-32S  [ESP-32S]
R5  4.7k  R-EU_R0603  [R0603]
R26  4.7k  R-EU_R0603  [R0603]
R27  1k  R-EU_R0603  [R0603]
R73  12k  R-EU_R0805  [R0805]
R74  12k  R-EU_R0805  [R0805]
R75  220R  R-EU_R0805  [R0805]
R98  10k  R-EU_R0603  [R0603]
R99  10k  R-EU_R0603  [R0603]
R100  1M  R-EU_R0603  [R0603]
R101  nc  R-EU_R0603  [R0603]
R102  nc  R-EU_R0603  [R0603]
R103  10k  R-EU_R0603  [R0603]
R104  10k  R-EU_R0603  [R0603]
R105  4.7k  R-EU_R0603  [R0603]
R106  4.7k  R-EU_R0603  [R0603]
R111  10k  R-EU_R0603  [R0603]
R112  10k  R-EU_R0603  [R0603]
R113  10k  R-EU_R0603  [R0603]
R114  10k  R-EU_R0603  [R0603]
R115  10k  R-EU_R0603  [R0603]
R116  10k  R-EU_R0603  [R0603]
R117  10k  R-EU_R0603  [R0603]
R118  10k  R-EU_R0603  [R0603]
RGB_LED  RGB_LED  PINHD-1X4  [1X04]
RTCC  AB-RTCMC-32.768KHZ-B5ZE-S3-T  [AB-RTCMC-32.768KHZ-B5ZE-S3-T]
X5  FPS009-3000  [FPS009-3000]

### Nets
3V3: C67.2 C82.1 CAMERA.3 L3.2 MCU_3_ESP32.2(3V3) R5.1 R26.1 R27.1 R73.1 R74.2 R98.2 R99.2 R101.1 R102.1 R103.2 R104.2 R105.2 R106.2 RTCC.1(VDD) ; also sheet 1,2,3,4,6,7,8,10,11
5V: DISPLAY.3 ; also sheet 1,2,10,11
CP2102_RXD: MCU_3_ESP32.35(U0TXD) ; also sheet 6,11
CP2102_TXD: MCU_3_ESP32.34(U0RXD) ; also sheet 6,11
GND: BATT1.MINUS BOOT.3 BUTTONS.10 C1.2 C4.2 C67.1 C73.2 C74.2 C75.2 C76.2 C77.2 C78.2 C81.2 C82.2 CAMERA.4 DISPLAY.4 EN.3 LED1.C MCU_3_ESP32.1(GND) MCU_3_ESP32.15(GND) MCU_3_ESP32.38(GND) MCU_3_ESP32.GND R100.2 R111.2 R112.2 R113.2 R114.2 R115.2 R116.2 R117.2 R118.2 RGB_LED.4 RTCC.7(VSS) X5.3 X5.6 X5.COM_TERM ; also sheet 1,2,3,4,6,7,8,9,10
MCU_3_BUTTON_0: BUTTONS.1 C1.1 MCU_3_ESP32.6(IO34) R111.1
MCU_3_BUTTON_1: BUTTONS.2 C4.1 MCU_3_ESP32.7(IO35) R112.1
MCU_3_BUTTON_2: BUTTONS.3 C73.1 MCU_3_ESP32.8(IO32) R113.1
MCU_3_BUTTON_3: BUTTONS.4 C74.1 MCU_3_ESP32.9(IO33) R114.1
MCU_3_BUTTON_4: BUTTONS.5 C75.1 MCU_3_ESP32.10(IO25) R115.1
MCU_3_BUTTON_5: BUTTONS.6 C76.1 MCU_3_ESP32.11(IO26) R116.1
MCU_3_BUTTON_6: BUTTONS.7 C77.1 MCU_3_ESP32.12(IO27) R117.1
MCU_3_BUTTON_7: BUTTONS.8 C78.1 MCU_3_ESP32.13(IO14) R118.1
MCU_3_I2C_SCL: DISPLAY.1 MCU_3_ESP32.36(IO22) R5.2 R105.1 RTCC.3(SCL) ; also sheet 11
MCU_3_I2C_SDA: DISPLAY.2 MCU_3_ESP32.33(IO21) R26.2 R106.1 RTCC.4(SDA) ; also sheet 11
MCU_3_LED_B: MCU_3_ESP32.23(IO15) RGB_LED.3
MCU_3_LED_G: MCU_3_ESP32.24(IO2) RGB_LED.2
MCU_3_LED_R: MCU_3_ESP32.26(IO4) RGB_LED.1
MCU_3_SD_DET: MCU_3_ESP32.22(SD1) R103.1 X5.DETECT
MCU_3_SD_WRTPT: MCU_3_ESP32.21(SD0) R104.1 X5.WRITE_PROT
MCU_3_SPI_MISO: MCU_3_ESP32.31(IO19) R99.1 X5.7
MCU_3_SPI_MOSI: MCU_3_ESP32.37(IO23) R98.1 X5.2
MCU_3_SPI_SCK: MCU_3_ESP32.30(IO18) X5.5
MCU_3_SPI_SS: MCU_3_ESP32.29(IO5) R100.1 X5.1
MCU_3_TRIGGER_CAMERA: CAMERA.1 MCU_3_ESP32.14(IO12)
MCU_3_UART1_RX: MCU_3_ESP32.17(SD2) ; also sheet 3,11
MCU_3_UART1_TX: MCU_3_ESP32.18(SD3) ; also sheet 3,11
MCU_3_UART2_RX: MCU_3_ESP32.27(IO16) ; also sheet 4,10
MCU_3_UART2_TX: MCU_3_ESP32.28(IO17) ; also sheet 4,10
N$23: BUTTONS.9 R27.2
N$78: BOOT.1 MCU_3_ESP32.25(IO0) R74.1
N$79: EN.1 MCU_3_ESP32.3(EN) R73.2
N$80: MCU_3_ESP32.16(IO13) R75.2
N$81: LED1.A R75.1
N$104: R102.2 X5.9
N$105: R101.2 X5.8
N$106: BATT1.PLUS RTCC.8(VBAT)
N$107: C81.1 L3.1 X5.4
Unconnected: CAMERA.2 MCU_3_ESP32.4(SVP) MCU_3_ESP32.5(SVN) MCU_3_ESP32.19(CMD) MCU_3_ESP32.20(CLK) RTCC.2(!INT_1) RTCC.5(CLKOUT) RTCC.6(!INT_2) RTCC.9(NC) RTCC.10(NC)

### Notes on the sheet
- ESP32 | Accessories
- SD Card | RTCC
- MCU_3
  ESP32

## Sheet 6 of 11: CP2102
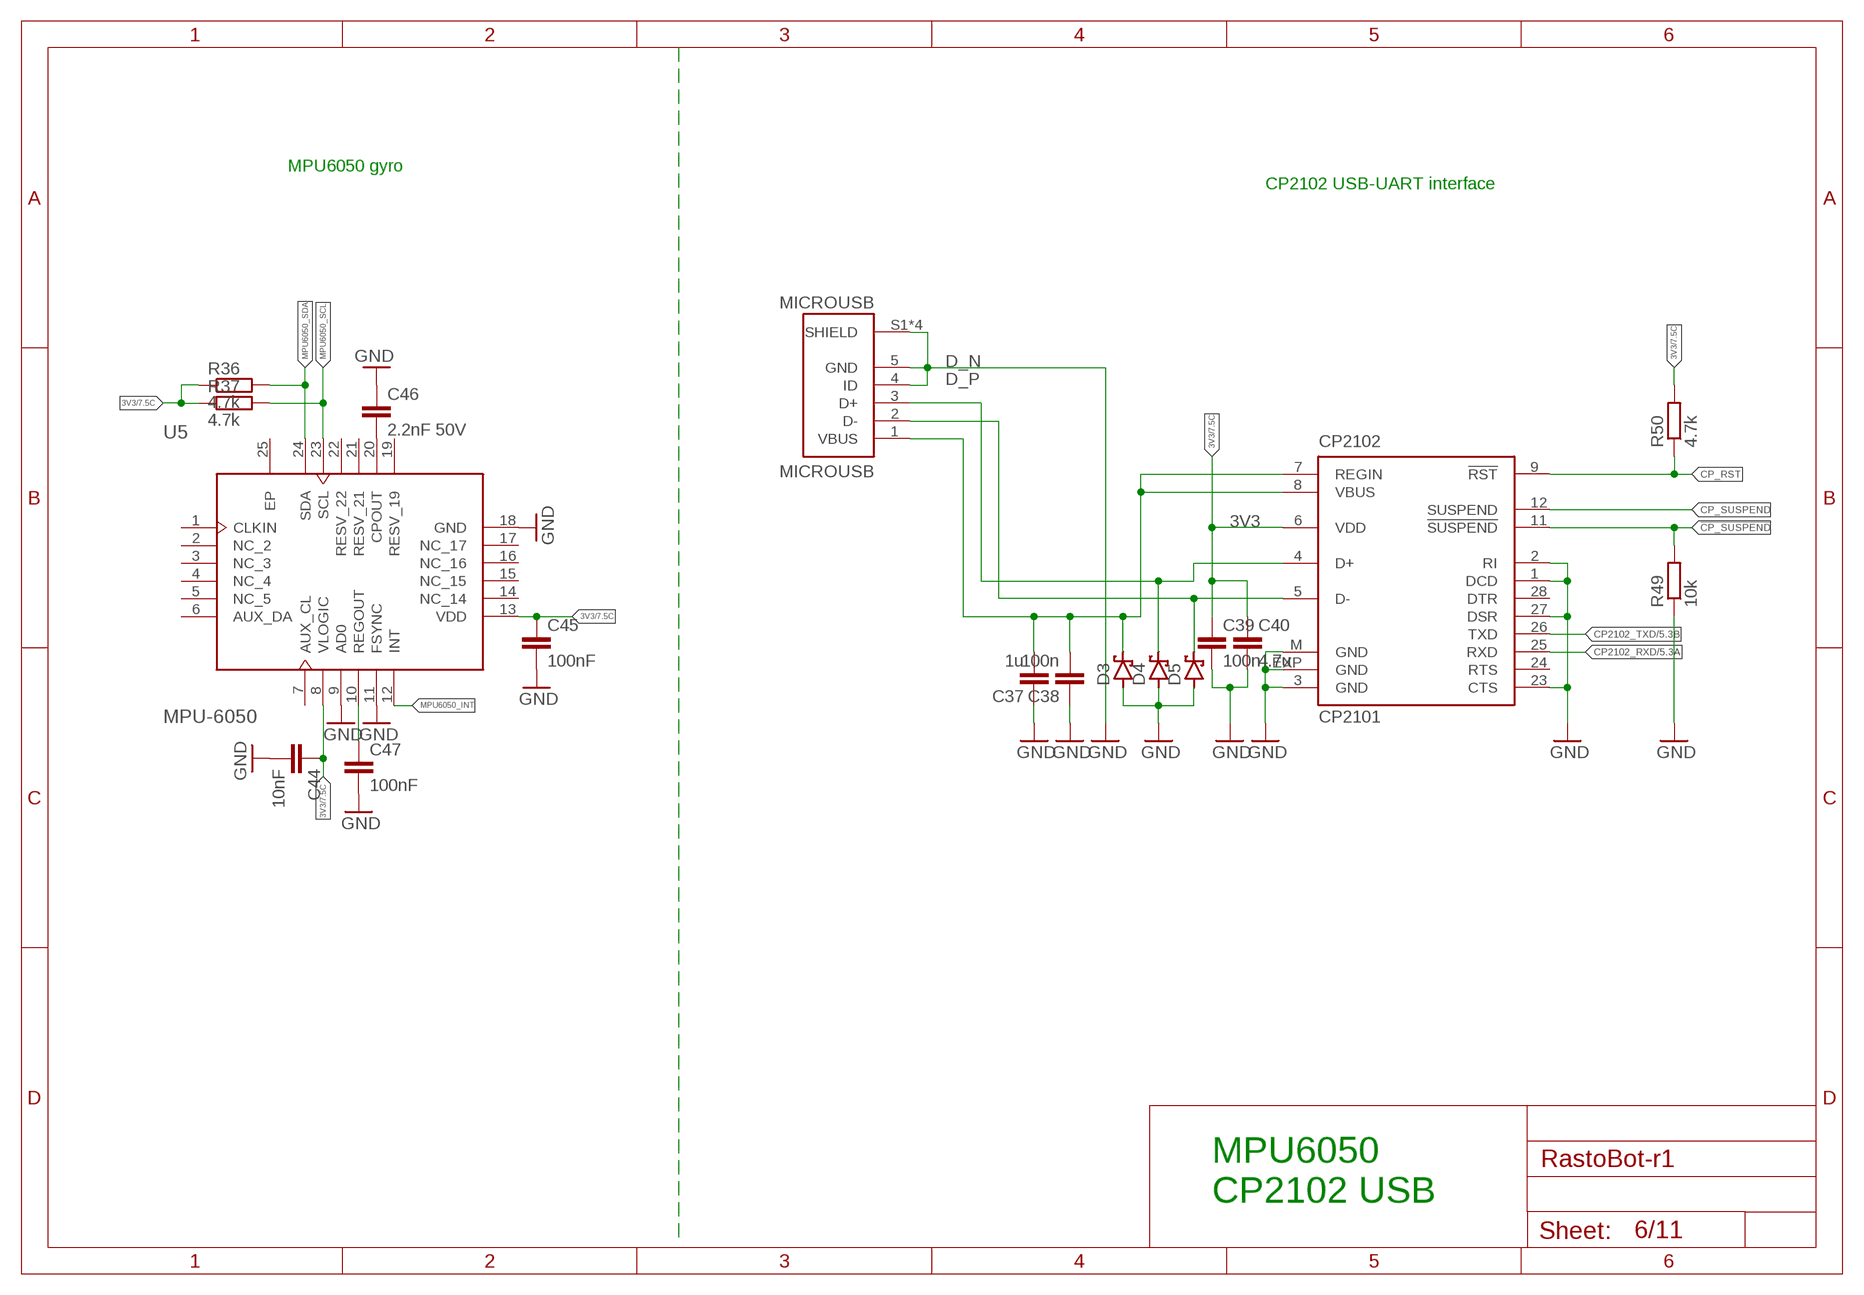
[diagram p5: schematic, sheet 6]

### Parts
C37  1u  C-EUC0603  [C0603]
C38  100n  C-EUC0603  [C0603]
C39  100n  C-EUC0603  [C0603]
C40  4.7u  C-EUC0603  [C0603]
C44  10nF  C-EUC0603  [C0603]
C45  100nF  C-EUC0603  [C0603]
C46  2.2nF 50V  C-EUC0603  [C0603]
C47  100nF  C-EUC0603  [C0603]
CP2102  CP2101  [MLP28]
D3  BAT60J  [SOD323_ST]
D4  BAT60J  [SOD323_ST]
D5  BAT60J  [SOD323_ST]
MICROUSB  MICROUSB  [MOLEX_47642-0001]
R36  4.7k  R-EU_R0603  [R0603]
R37  4.7k  R-EU_R0603  [R0603]
R49  10k  R-EU_R0603  [R0603]
R50  4.7k  R-EU_R0603  [R0603]
U5  MPU-6050  [24-VFQFN]

### Nets
3V3: C39.1 C40.1 C44.1 C45.1 CP2102.6(VDD) R36.1 R37.1 R50.2 U5.8(VLOGIC) U5.13(VDD) ; also sheet 1,2,3,4,5,7,8,10,11
!CP_SUSPEND: CP2102.11(!SUSPEND) R49.2
CP2102_RXD: CP2102.25(RXD) ; also sheet 5,11
CP2102_TXD: CP2102.26(TXD) ; also sheet 5,11
CP_RST: CP2102.9(!RST) R50.1
CP_SUSPEND: CP2102.12(SUSPEND)
D_N: CP2102.5(D-) D5.C MICROUSB.2(D-)
D_P: CP2102.4(D+) D4.C MICROUSB.3(D+)
GND: C37.1 C38.1 C39.2 C40.2 C44.2 C45.2 C46.1 C47.2 CP2102.1(DCD) CP2102.2(RI) CP2102.3(GND) CP2102.23(CTS) CP2102.27(DSR) CP2102.EXP(GND) CP2102.M(GND) D3.A D4.A D5.A MICROUSB.4(ID) MICROUSB.5(GND) MICROUSB.S1(SHIELD) MICROUSB.S2(SHIELD) MICROUSB.S3(SHIELD) MICROUSB.S4(SHIELD) R49.1 U5.9(AD0) U5.11(FSYNC) U5.18(GND) ; also sheet 1,2,3,4,5,7,8,9,10
MPU6050_INT: U5.12(INT)
MPU6050_SCL: R37.2 U5.23(SCL) ; also sheet 4,11
MPU6050_SDA: R36.2 U5.24(SDA) ; also sheet 4,11
N$7: C37.2 C38.2 CP2102.7(REGIN) CP2102.8(VBUS) D3.C MICROUSB.1(VBUS)
N$43: C46.2 U5.20(CPOUT)
N$44: C47.1 U5.10(REGOUT)
Unconnected: CP2102.24(RTS) CP2102.28(DTR) U5.1(CLKIN) U5.2(NC_2) U5.3(NC_3) U5.4(NC_4) U5.5(NC_5) U5.6(AUX_DA) U5.7(AUX_CL) U5.14(NC_14) U5.15(NC_15) U5.16(NC_16) U5.17(NC_17) U5.19(RESV_19) U5.21(RESV_21) U5.22(RESV_22)

### Notes on the sheet
- MPU6050 gyro
- CP2102 USB-UART interface
- MPU6050
  CP2102 USB

## Sheet 7 of 11: Current sensors
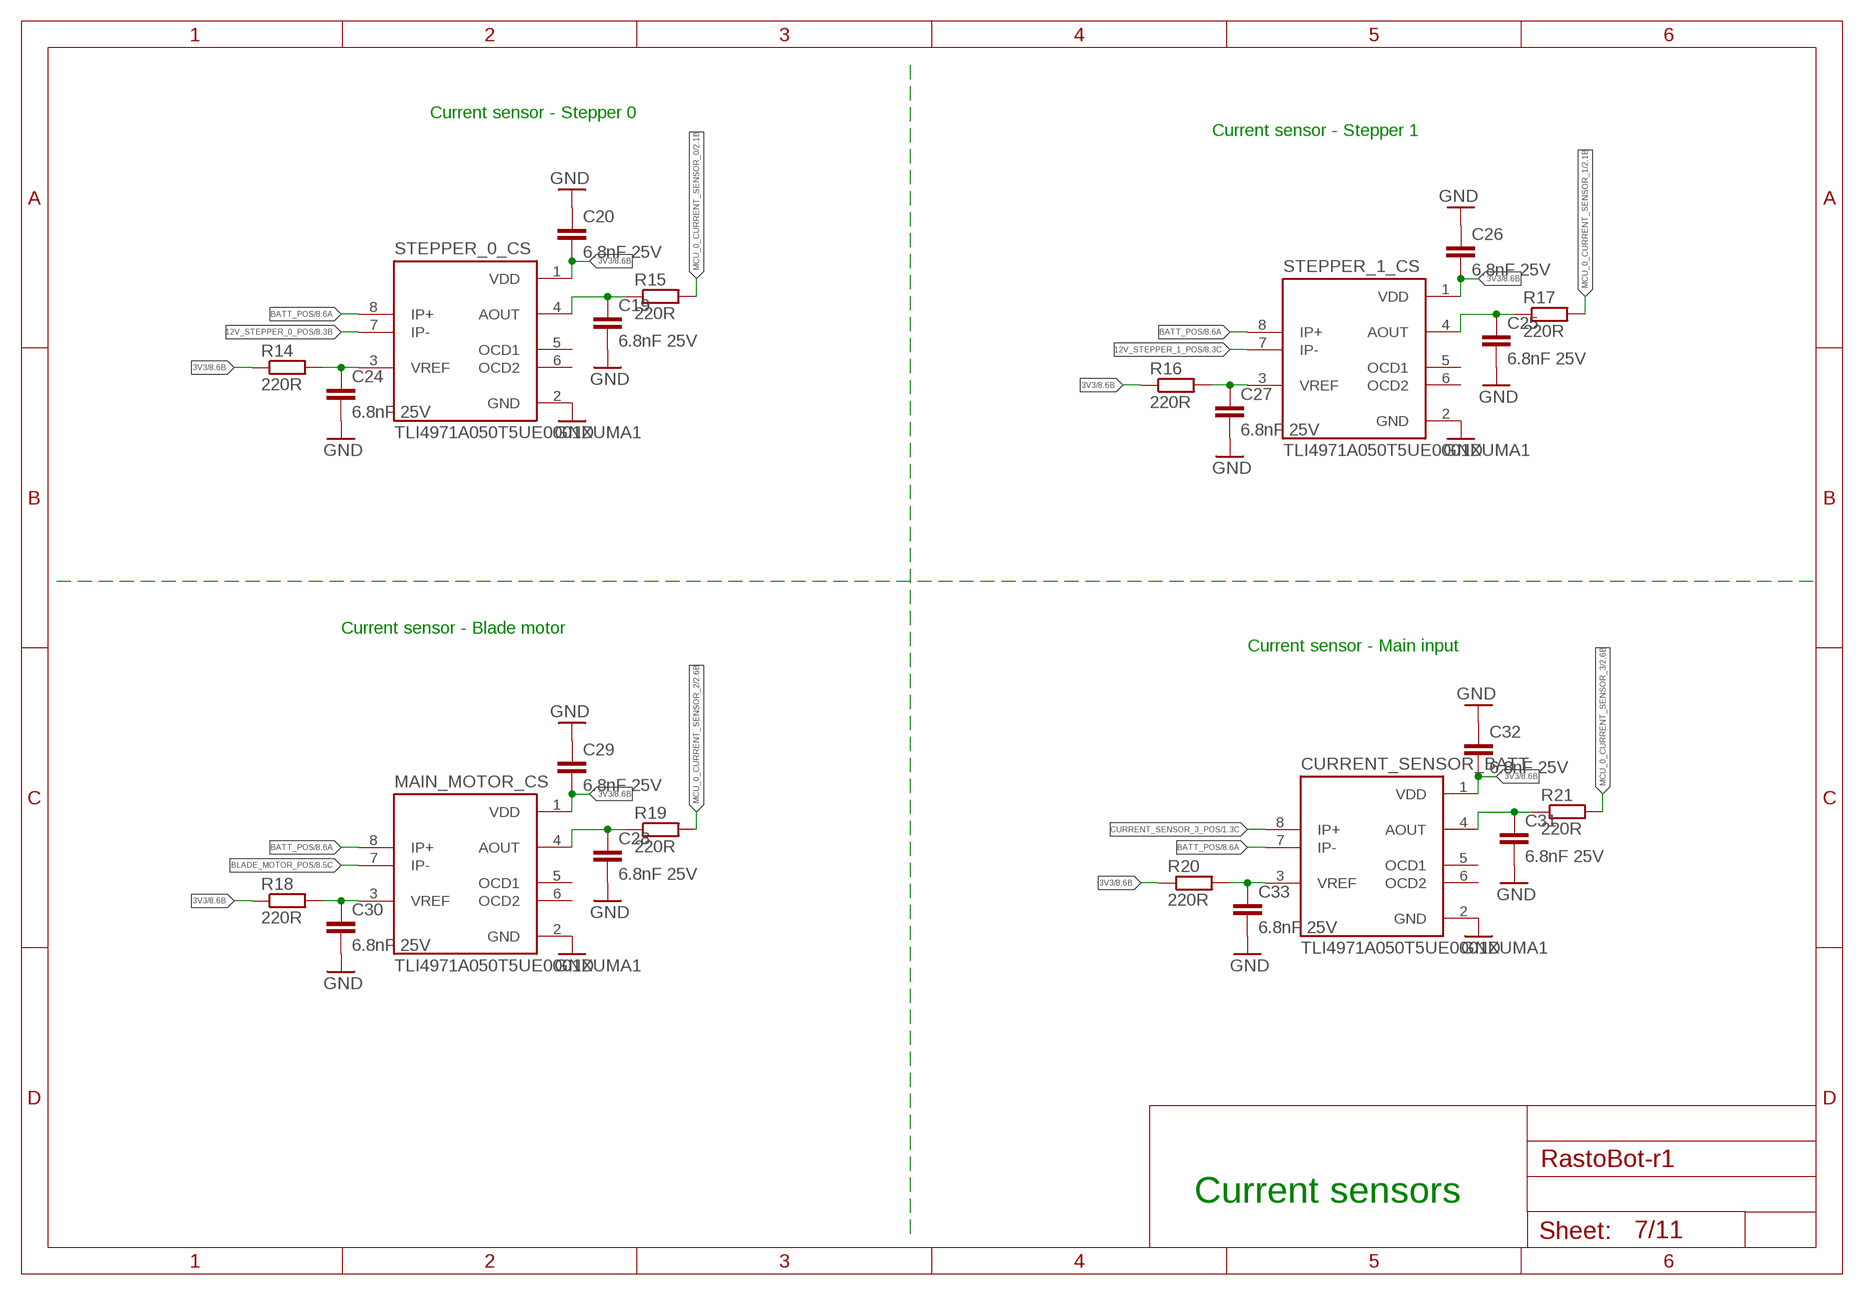
[diagram p6: schematic, sheet 7]

### Parts
C19  6.8nF 25V  C-EUC0603  [C0603]
C20  6.8nF 25V  C-EUC0603  [C0603]
C24  6.8nF 25V  C-EUC0603  [C0603]
C25  6.8nF 25V  C-EUC0603  [C0603]
C26  6.8nF 25V  C-EUC0603  [C0603]
C27  6.8nF 25V  C-EUC0603  [C0603]
C28  6.8nF 25V  C-EUC0603  [C0603]
C29  6.8nF 25V  C-EUC0603  [C0603]
C30  6.8nF 25V  C-EUC0603  [C0603]
C31  6.8nF 25V  C-EUC0603  [C0603]
C32  6.8nF 25V  C-EUC0603  [C0603]
C33  6.8nF 25V  C-EUC0603  [C0603]
CURRENT_SENSOR_BATT  TLI4971A050T5UE0001XUMA1  [IC_TLI4971A050T5UE0001XUMA1]
MAIN_MOTOR_CS  TLI4971A050T5UE0001XUMA1  [IC_TLI4971A050T5UE0001XUMA1]
R14  220R  R-EU_R0805  [R0805]
R15  220R  R-EU_R0805  [R0805]
R16  220R  R-EU_R0805  [R0805]
R17  220R  R-EU_R0805  [R0805]
R18  220R  R-EU_R0805  [R0805]
R19  220R  R-EU_R0805  [R0805]
R20  220R  R-EU_R0805  [R0805]
R21  220R  R-EU_R0805  [R0805]
STEPPER_0_CS  TLI4971A050T5UE0001XUMA1  [IC_TLI4971A050T5UE0001XUMA1]
STEPPER_1_CS  TLI4971A050T5UE0001XUMA1  [IC_TLI4971A050T5UE0001XUMA1]

### Nets
3V3: C20.2 C26.2 C29.2 C32.2 CURRENT_SENSOR_BATT.1(VDD) MAIN_MOTOR_CS.1(VDD) R14.1 R16.1 R18.1 R20.1 STEPPER_0_CS.1(VDD) STEPPER_1_CS.1(VDD) ; also sheet 1,2,3,4,5,6,8,10,11
12V_STEPPER_0_POS: STEPPER_0_CS.7(IP-) ; also sheet 8
12V_STEPPER_1_POS: STEPPER_1_CS.7(IP-) ; also sheet 8
BATT_POS: CURRENT_SENSOR_BATT.7(IP-) MAIN_MOTOR_CS.8(IP+) STEPPER_0_CS.8(IP+) STEPPER_1_CS.8(IP+) ; also sheet 1,8,9,10,11
BLADE_MOTOR_POS: MAIN_MOTOR_CS.7(IP-) ; also sheet 8
CURRENT_SENSOR_3_POS: CURRENT_SENSOR_BATT.8(IP+) ; also sheet 1
GND: C19.2 C20.1 C24.2 C25.2 C26.1 C27.2 C28.2 C29.1 C30.2 C31.2 C32.1 C33.2 CURRENT_SENSOR_BATT.2(GND) MAIN_MOTOR_CS.2(GND) STEPPER_0_CS.2(GND) STEPPER_1_CS.2(GND) ; also sheet 1,2,3,4,5,6,8,9,10
MCU_0_CURRENT_SENSOR_0: R15.2 ; also sheet 2,11
MCU_0_CURRENT_SENSOR_1: R17.2 ; also sheet 2,11
MCU_0_CURRENT_SENSOR_2: R19.2 ; also sheet 2,11
MCU_0_CURRENT_SENSOR_3: R21.2 ; also sheet 2,11
N$12: C19.1 R15.1 STEPPER_0_CS.4(AOUT)
N$13: C27.1 R16.2 STEPPER_1_CS.3(VREF)
N$16: C25.1 R17.1 STEPPER_1_CS.4(AOUT)
N$17: C24.1 R14.2 STEPPER_0_CS.3(VREF)
N$18: C30.1 MAIN_MOTOR_CS.3(VREF) R18.2
N$19: C28.1 MAIN_MOTOR_CS.4(AOUT) R19.1
N$20: C33.1 CURRENT_SENSOR_BATT.3(VREF) R20.2
N$21: C31.1 CURRENT_SENSOR_BATT.4(AOUT) R21.1
Unconnected: CURRENT_SENSOR_BATT.5(OCD1) CURRENT_SENSOR_BATT.6(OCD2) MAIN_MOTOR_CS.5(OCD1) MAIN_MOTOR_CS.6(OCD2) STEPPER_0_CS.5(OCD1) STEPPER_0_CS.6(OCD2) STEPPER_1_CS.5(OCD1) STEPPER_1_CS.6(OCD2)

### Notes on the sheet
- Current sensor - Stepper 0
- Current sensor - Stepper 1
- Current sensor - Blade motor
- Current sensor - Main input
- Current sensors

## Sheet 8 of 11: Motor drivers
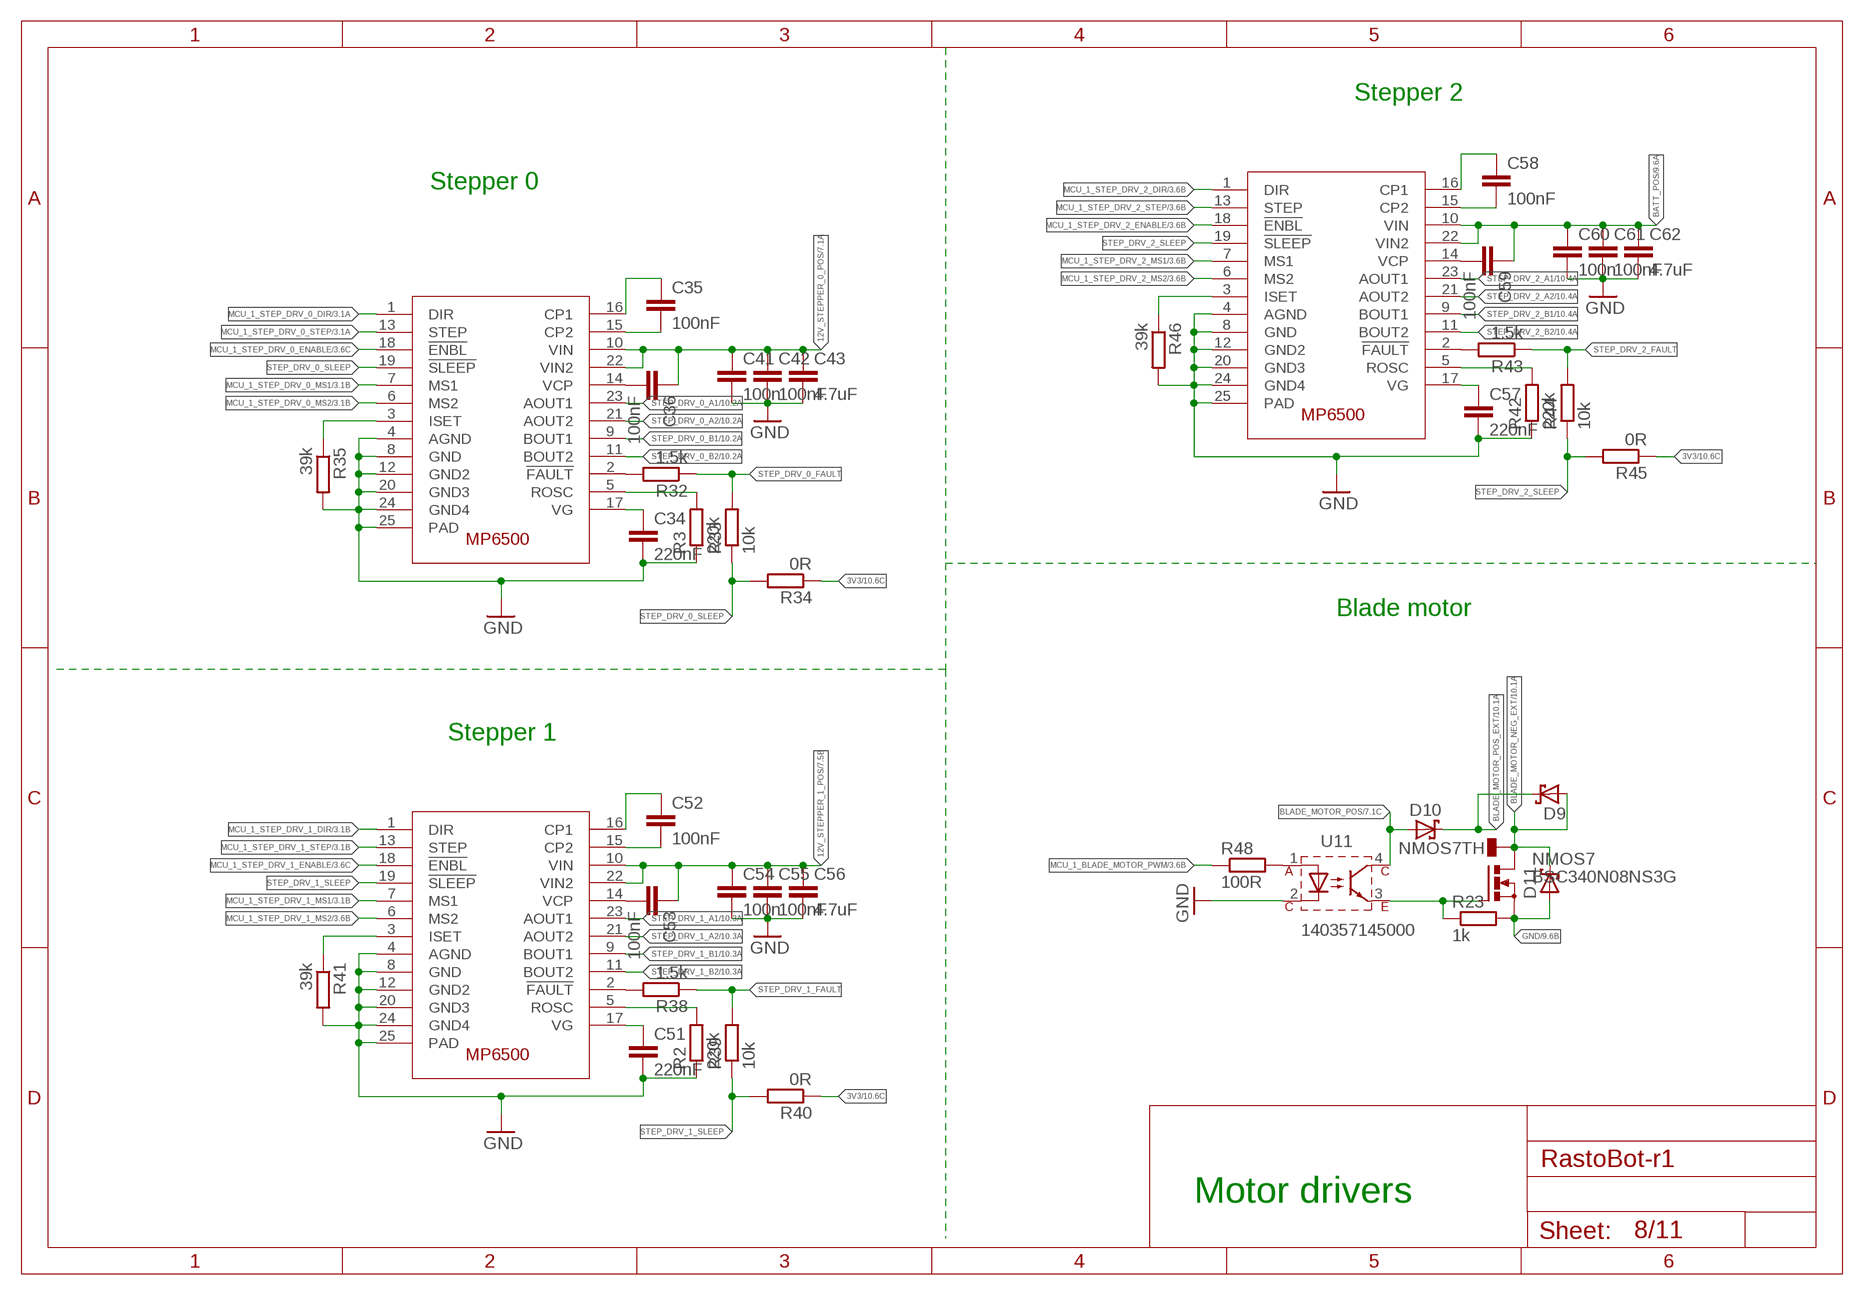
[diagram p7: schematic, sheet 8]

### Parts
C34  220nF  C-EUC0603  [C0603]
C35  100nF  C-EUC0603  [C0603]
C36  100nF  C-EUC0603  [C0603]
C41  100n  C-EUC0603  [C0603]
C42  100nF  C-EUC0603  [C0603]
C43  4.7uF  C-EUC0603  [C0603]
C51  220nF  C-EUC0603  [C0603]
C52  100nF  C-EUC0603  [C0603]
C53  100nF  C-EUC0603  [C0603]
C54  100n  C-EUC0603  [C0603]
C55  100nF  C-EUC0603  [C0603]
C56  4.7uF  C-EUC0603  [C0603]
C57  220nF  C-EUC0603  [C0603]
C58  100nF  C-EUC0603  [C0603]
C59  100nF  C-EUC0603  [C0603]
C60  100n  C-EUC0603  [C0603]
C61  100nF  C-EUC0603  [C0603]
C62  4.7uF  C-EUC0603  [C0603]
D9  SCHOTTKY-DIODEAG  [AG]
D10  SCHOTTKY-DIODEAG  [AG]
D11  SCHOTTKY-DIODEAG  [AG]
NMOS7  BSC340N08NS3G  [PG-TDSON-8]
R2  220k  R-EU_R0603  [R0603]
R3  220k  R-EU_R0603  [R0603]
R23  1k  R-EU_R0805  [R0805]
R32  1.5k  R-EU_R0603  [R0603]
R33  10k  R-EU_R0603  [R0603]
R34  0R  R-EU_R0603  [R0603]
R35  39k  R-EU_R0603  [R0603]
R38  1.5k  R-EU_R0603  [R0603]
R39  10k  R-EU_R0603  [R0603]
R40  0R  R-EU_R0603  [R0603]
R41  39k  R-EU_R0603  [R0603]
R42  220k  R-EU_R0603  [R0603]
R43  1.5k  R-EU_R0603  [R0603]
R44  10k  R-EU_R0603  [R0603]
R45  0R  R-EU_R0603  [R0603]
R46  39k  R-EU_R0603  [R0603]
R48  100R  R-EU_R0805  [R0805]
SD1  MP6500  [QFN65P500X500X100-25N]
SD2  MP6500  [QFN65P500X500X100-25N]
SD3  MP6500  [QFN65P500X500X100-25N]
U11  140357145000  WL-OCPT_SERIES_357_140357145000  [WL-OCPT_SOP4]

### Nets
3V3: R34.1 R40.1 R45.1 ; also sheet 1,2,3,4,5,6,7,10,11
12V_STEPPER_0_POS: C36.1 C41.1 C42.1 C43.1 SD1.10(VIN) SD1.22(VIN2) ; also sheet 7
12V_STEPPER_1_POS: C53.1 C54.1 C55.1 C56.1 SD2.10(VIN) SD2.22(VIN2) ; also sheet 7
BATT_POS: C59.1 C60.1 C61.1 C62.1 SD3.10(VIN) SD3.22(VIN2) ; also sheet 1,7,9,10,11
BLADE_MOTOR_NEG_EXT: D9.A D11.C NMOS7.5(D) NMOS7.6(D) NMOS7.7(D) NMOS7.8(D) NMOS7.TH ; also sheet 10
BLADE_MOTOR_POS: D10.A U11.4 ; also sheet 7
BLADE_MOTOR_POS_EXT: D9.C D10.C ; also sheet 10
GND: C34.2 C41.2 C42.2 C43.2 C51.2 C54.2 C55.2 C56.2 C57.2 C60.2 C61.2 C62.2 D11.A NMOS7.1(S) NMOS7.2(S) NMOS7.3(S) R2.1 R3.1 R23.2 R35.2 R41.2 R42.1 R46.2 SD1.4(AGND) SD1.8(GND) SD1.12(GND2) SD1.20(GND3) SD1.24(GND4) SD1.25(PAD) SD2.4(AGND) SD2.8(GND) SD2.12(GND2) SD2.20(GND3) SD2.24(GND4) SD2.25(PAD) SD3.4(AGND) SD3.8(GND) SD3.12(GND2) SD3.20(GND3) SD3.24(GND4) SD3.25(PAD) U11.2 ; also sheet 1,2,3,4,5,6,7,9,10
MCU_1_BLADE_MOTOR_PWM: R48.1 ; also sheet 3
MCU_1_STEP_DRV_0_DIR: SD1.1(DIR) ; also sheet 3
MCU_1_STEP_DRV_0_ENABLE: SD1.18(!ENBL) ; also sheet 3
MCU_1_STEP_DRV_0_MS1: SD1.7(MS1) ; also sheet 3
MCU_1_STEP_DRV_0_MS2: SD1.6(MS2) ; also sheet 3
MCU_1_STEP_DRV_0_STEP: SD1.13(STEP) ; also sheet 3
MCU_1_STEP_DRV_1_DIR: SD2.1(DIR) ; also sheet 3
MCU_1_STEP_DRV_1_ENABLE: SD2.18(!ENBL) ; also sheet 3
MCU_1_STEP_DRV_1_MS1: SD2.7(MS1) ; also sheet 3
MCU_1_STEP_DRV_1_MS2: SD2.6(MS2) ; also sheet 3
MCU_1_STEP_DRV_1_STEP: SD2.13(STEP) ; also sheet 3
MCU_1_STEP_DRV_2_DIR: SD3.1(DIR) ; also sheet 3
MCU_1_STEP_DRV_2_ENABLE: SD3.18(!ENBL) ; also sheet 3
MCU_1_STEP_DRV_2_MS1: SD3.7(MS1) ; also sheet 3
MCU_1_STEP_DRV_2_MS2: SD3.6(MS2) ; also sheet 3
MCU_1_STEP_DRV_2_STEP: SD3.13(STEP) ; also sheet 3
N$4: C34.1 SD1.17(VG)
N$8: R3.2 SD1.5(ROSC)
N$25: R48.2 U11.1
N$26: NMOS7.4(G) R23.1 U11.3
N$32: C35.2 SD1.15(CP2)
N$33: C35.1 SD1.16(CP1)
N$34: R32.2 SD1.2(!FAULT)
N$36: C36.2 SD1.14(VCP)
N$37: C51.1 SD2.17(VG)
N$40: R35.1 SD1.3(ISET)
N$41: R2.2 SD2.5(ROSC)
N$42: C52.2 SD2.15(CP2)
N$45: C52.1 SD2.16(CP1)
N$46: C53.2 SD2.14(VCP)
N$47: R41.1 SD2.3(ISET)
N$48: R38.2 SD2.2(!FAULT)
N$49: C57.1 SD3.17(VG)
N$50: R42.2 SD3.5(ROSC)
N$51: C58.2 SD3.15(CP2)
N$52: C58.1 SD3.16(CP1)
N$53: C59.2 SD3.14(VCP)
N$54: R46.1 SD3.3(ISET)
N$55: R43.2 SD3.2(!FAULT)
STEP_DRV_0_A1: SD1.23(AOUT1) ; also sheet 10
STEP_DRV_0_A2: SD1.21(AOUT2) ; also sheet 10
STEP_DRV_0_B1: SD1.9(BOUT1) ; also sheet 10
STEP_DRV_0_B2: SD1.11(BOUT2) ; also sheet 10
STEP_DRV_0_FAULT: R32.1 R33.2
STEP_DRV_0_SLEEP: R33.1 R34.2 SD1.19(!SLEEP)
STEP_DRV_1_A1: SD2.23(AOUT1) ; also sheet 10
STEP_DRV_1_A2: SD2.21(AOUT2) ; also sheet 10
STEP_DRV_1_B1: SD2.9(BOUT1) ; also sheet 10
STEP_DRV_1_B2: SD2.11(BOUT2) ; also sheet 10
STEP_DRV_1_FAULT: R38.1 R39.2
STEP_DRV_1_SLEEP: R39.1 R40.2 SD2.19(!SLEEP)
STEP_DRV_2_A1: SD3.23(AOUT1) ; also sheet 10
STEP_DRV_2_A2: SD3.21(AOUT2) ; also sheet 10
STEP_DRV_2_B1: SD3.9(BOUT1) ; also sheet 10
STEP_DRV_2_B2: SD3.11(BOUT2) ; also sheet 10
STEP_DRV_2_FAULT: R43.1 R44.2
STEP_DRV_2_SLEEP: R44.1 R45.2 SD3.19(!SLEEP)

### Notes on the sheet
- Stepper 2
- Stepper 0
- Blade motor
- Stepper 1
- Motor drivers

## Sheet 9 of 11: Fans
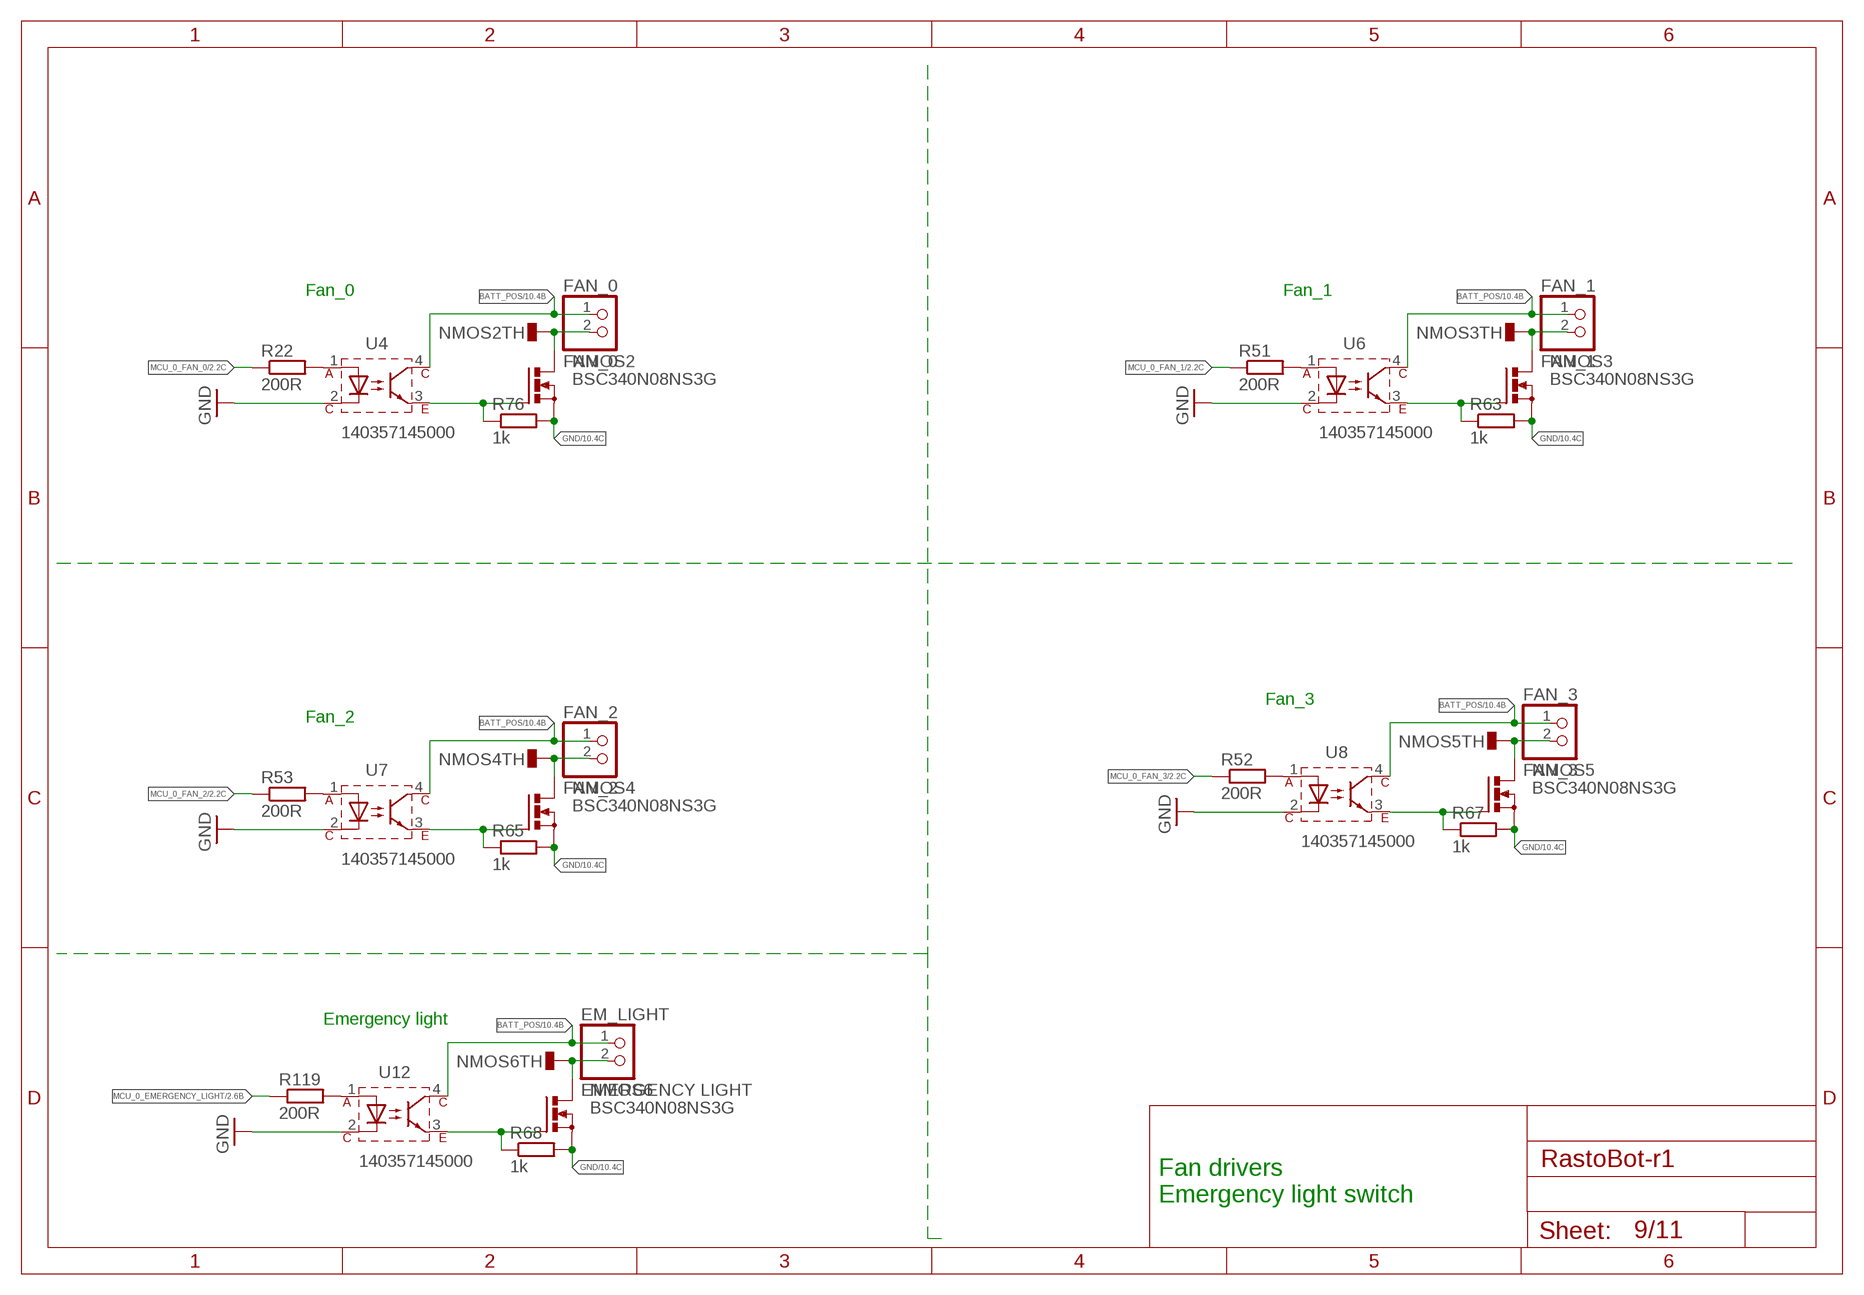
[diagram p8: schematic, sheet 9]

### Parts
EM_LIGHT  EMERGENCY LIGHT  PINHD-1X2  [1X02]
FAN_0  FAN_0  PINHD-1X2  [1X02]
FAN_1  FAN_1  PINHD-1X2  [1X02]
FAN_2  FAN_2  PINHD-1X2  [1X02]
FAN_3  FAN_3  PINHD-1X2  [1X02]
NMOS2  BSC340N08NS3G  [PG-TDSON-8]
NMOS3  BSC340N08NS3G  [PG-TDSON-8]
NMOS4  BSC340N08NS3G  [PG-TDSON-8]
NMOS5  BSC340N08NS3G  [PG-TDSON-8]
NMOS6  BSC340N08NS3G  [PG-TDSON-8]
R22  200R  R-EU_R0805  [R0805]
R51  200R  R-EU_R0805  [R0805]
R52  200R  R-EU_R0805  [R0805]
R53  200R  R-EU_R0805  [R0805]
R63  1k  R-EU_R0805  [R0805]
R65  1k  R-EU_R0805  [R0805]
R67  1k  R-EU_R0805  [R0805]
R68  1k  R-EU_R0805  [R0805]
R76  1k  R-EU_R0805  [R0805]
R119  200R  R-EU_R0805  [R0805]
U4  140357145000  WL-OCPT_SERIES_357_140357145000  [WL-OCPT_SOP4]
U6  140357145000  WL-OCPT_SERIES_357_140357145000  [WL-OCPT_SOP4]
U7  140357145000  WL-OCPT_SERIES_357_140357145000  [WL-OCPT_SOP4]
U8  140357145000  WL-OCPT_SERIES_357_140357145000  [WL-OCPT_SOP4]
U12  140357145000  WL-OCPT_SERIES_357_140357145000  [WL-OCPT_SOP4]

### Nets
BATT_POS: EM_LIGHT.1 FAN_0.1 FAN_1.1 FAN_2.1 FAN_3.1 U4.4 U6.4 U7.4 U8.4 U12.4 ; also sheet 1,7,8,10,11
GND: NMOS2.1(S) NMOS2.2(S) NMOS2.3(S) NMOS3.1(S) NMOS3.2(S) NMOS3.3(S) NMOS4.1(S) NMOS4.2(S) NMOS4.3(S) NMOS5.1(S) NMOS5.2(S) NMOS5.3(S) NMOS6.1(S) NMOS6.2(S) NMOS6.3(S) R63.2 R65.2 R67.2 R68.2 R76.2 U4.2 U6.2 U7.2 U8.2 U12.2 ; also sheet 1,2,3,4,5,6,7,8,10
MCU_0_EMERGENCY_LIGHT: R119.1 ; also sheet 2
MCU_0_FAN_0: R22.1 ; also sheet 2
MCU_0_FAN_1: R51.1 ; also sheet 2
MCU_0_FAN_2: R53.1 ; also sheet 2
MCU_0_FAN_3: R52.1 ; also sheet 2
N$22: NMOS6.4(G) R68.1 U12.3
N$35: EM_LIGHT.2 NMOS6.5(D) NMOS6.6(D) NMOS6.7(D) NMOS6.8(D) NMOS6.TH
N$39: R119.2 U12.1
N$62: R22.2 U4.1
N$65: FAN_0.2 NMOS2.5(D) NMOS2.6(D) NMOS2.7(D) NMOS2.8(D) NMOS2.TH
N$66: R51.2 U6.1
N$67: R52.2 U8.1
N$68: NMOS2.4(G) R76.1 U4.3
N$69: NMOS3.4(G) R63.1 U6.3
N$70: FAN_1.2 NMOS3.5(D) NMOS3.6(D) NMOS3.7(D) NMOS3.8(D) NMOS3.TH
N$71: R53.2 U7.1
N$72: NMOS4.4(G) R65.1 U7.3
N$73: FAN_2.2 NMOS4.5(D) NMOS4.6(D) NMOS4.7(D) NMOS4.8(D) NMOS4.TH
N$75: NMOS5.4(G) R67.1 U8.3
N$76: FAN_3.2 NMOS5.5(D) NMOS5.6(D) NMOS5.7(D) NMOS5.8(D) NMOS5.TH

### Notes on the sheet
- Fan_0 | Fan_1
- Fan_3
- Fan_2
- Emergency light
- Fan drivers
  Emergency light switch

## Sheet 10 of 11: Pinheaders
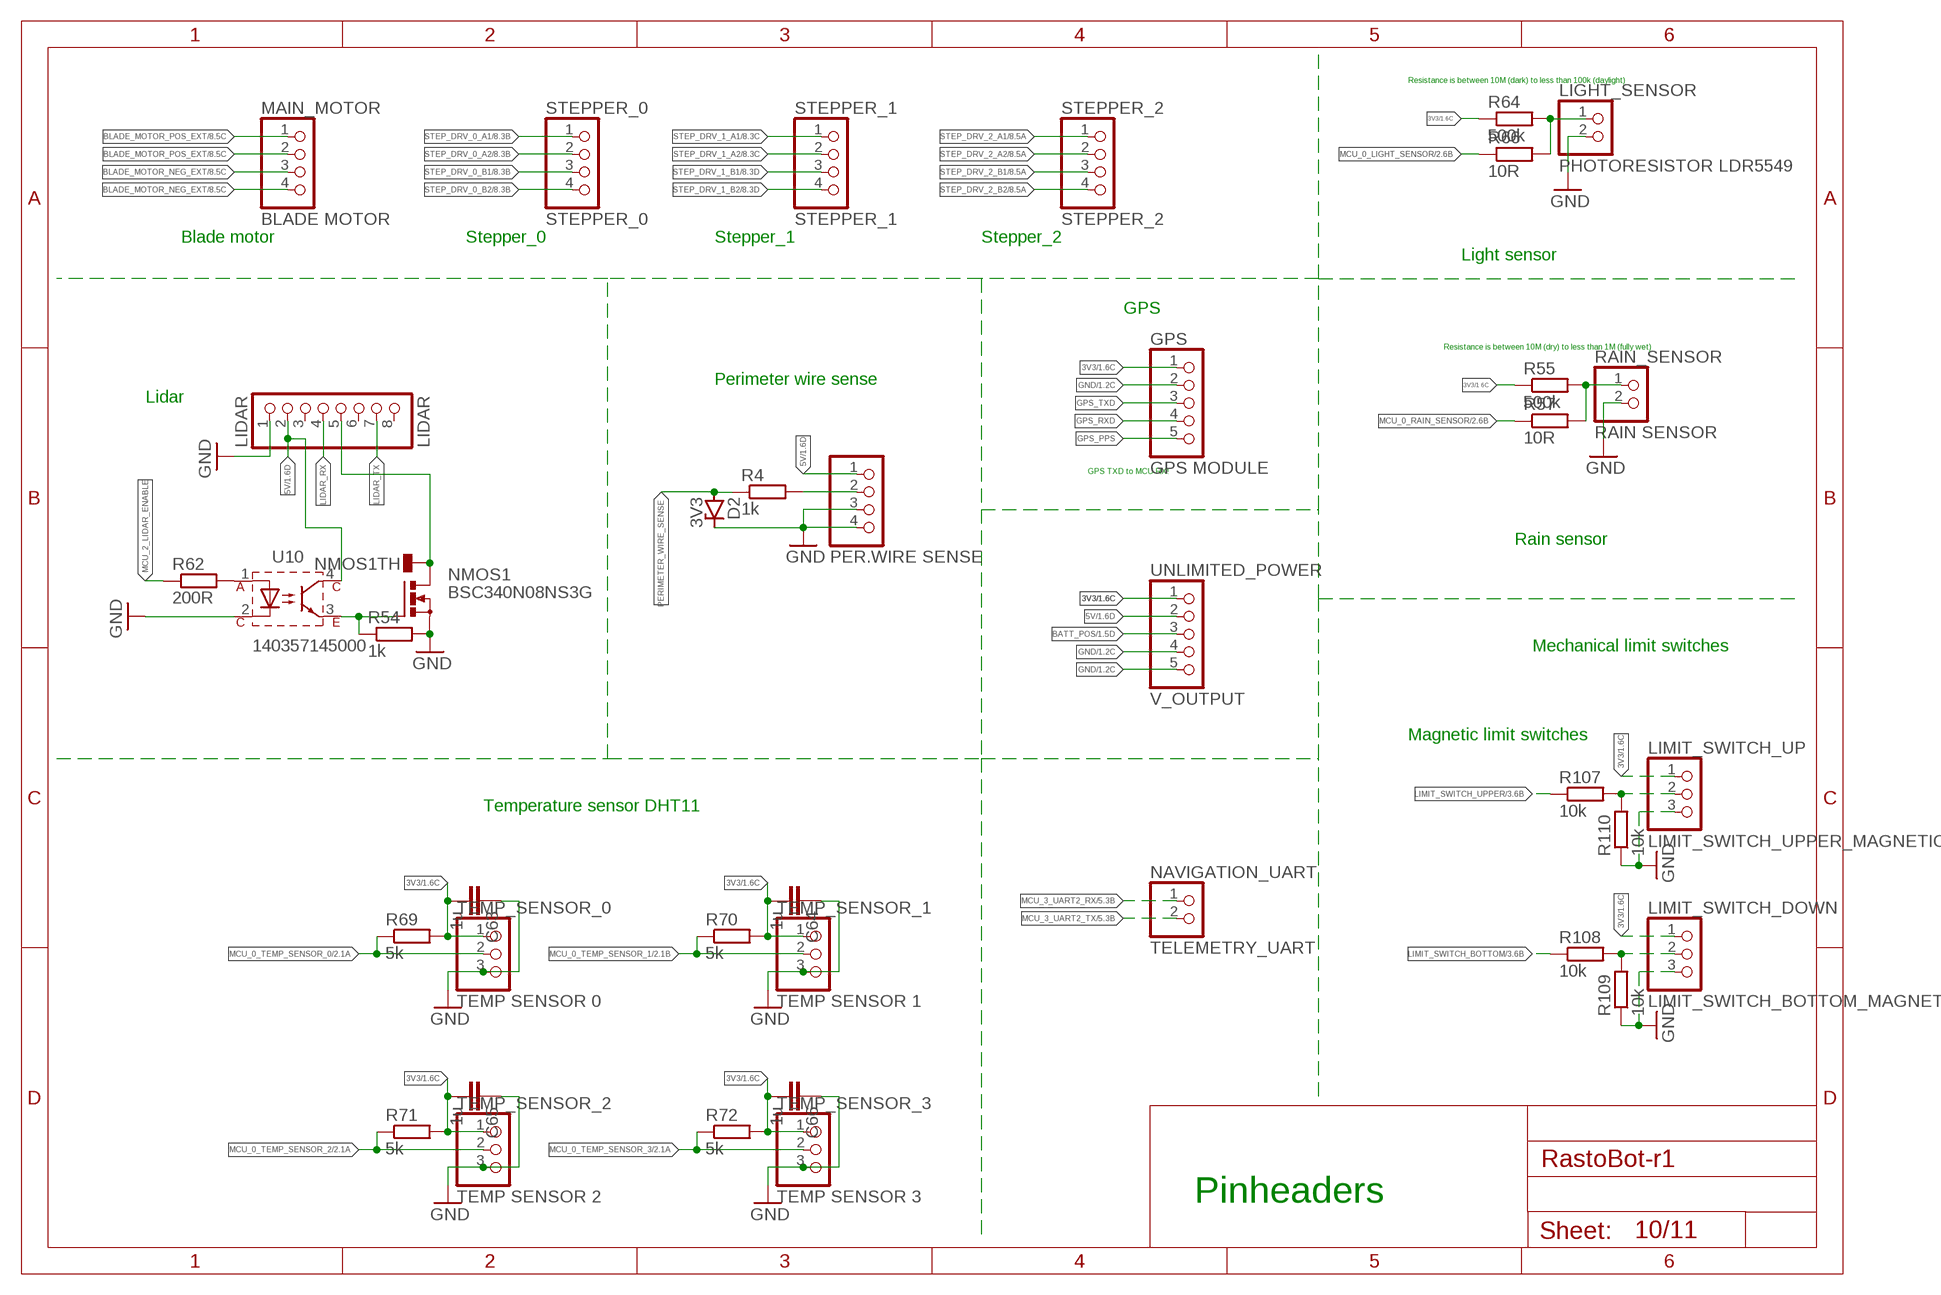
[diagram p9: schematic, sheet 10]

### Parts
C63  1u  C-EUC0603  [C0603]
C64  1u  C-EUC0603  [C0603]
C65  1u  C-EUC0603  [C0603]
C66  1u  C-EUC0603  [C0603]
D2  3V3  ZENER-DIODESOD80C  [SOD80C]
GPS  GPS MODULE  PINHD-1X5  [1X05]
LIDAR  LIDAR  PINHD-1X8  [1X08]
LIGHT_SENSOR  PHOTORESISTOR LDR5549  PINHD-1X2  [1X02]
LIMIT_SWITCH_DOWN  LIMIT_SWITCH_BOTTOM_MAGNETIC  PINHD-1X3  [1X03]
LIMIT_SWITCH_UP  LIMIT_SWITCH_UPPER_MAGNETIC  PINHD-1X3  [1X03]
MAIN_MOTOR  BLADE MOTOR  PINHD-1X4  [1X04]
NAVIGATION_UART  TELEMETRY_UART  PINHD-1X2  [1X02]
NMOS1  BSC340N08NS3G  [PG-TDSON-8]
PERIMETER_WIRE  PER.WIRE SENSE  PINHD-1X4  [1X04]
R4  1k  R-EU_R0805  [R0805]
R54  1k  R-EU_R0805  [R0805]
R55  500k  R-EU_R0805  [R0805]
R57  10R  R-EU_R0805  [R0805]
R62  200R  R-EU_R0805  [R0805]
R64  500k  R-EU_R0805  [R0805]
R66  10R  R-EU_R0805  [R0805]
R69  5k  R-EU_R0805  [R0805]
R70  5k  R-EU_R0805  [R0805]
R71  5k  R-EU_R0805  [R0805]
R72  5k  R-EU_R0805  [R0805]
R107  10k  R-EU_R0805  [R0805]
R108  10k  R-EU_R0805  [R0805]
R109  10k  R-EU_R0805  [R0805]
R110  10k  R-EU_R0805  [R0805]
RAIN_SENSOR  RAIN SENSOR  PINHD-1X2  [1X02]
STEPPER_0  STEPPER_0  PINHD-1X4  [1X04]
STEPPER_1  STEPPER_1  PINHD-1X4  [1X04]
STEPPER_2  STEPPER_2  PINHD-1X4  [1X04]
TEMP_SENSOR_0  TEMP SENSOR 0  PINHD-1X3  [1X03]
TEMP_SENSOR_1  TEMP SENSOR 1  PINHD-1X3  [1X03]
TEMP_SENSOR_2  TEMP SENSOR 2  PINHD-1X3  [1X03]
TEMP_SENSOR_3  TEMP SENSOR 3  PINHD-1X3  [1X03]
U10  140357145000  WL-OCPT_SERIES_357_140357145000  [WL-OCPT_SOP4]
UNLIMITED_POWER  V_OUTPUT  PINHD-1X5  [1X05]

### Nets
3V3: C63.2 C64.2 C65.2 C66.2 GPS.1 LIMIT_SWITCH_DOWN.1 LIMIT_SWITCH_UP.1 R55.1 R64.1 R69.2 R70.2 R71.2 R72.2 TEMP_SENSOR_0.1 TEMP_SENSOR_1.1 TEMP_SENSOR_2.1 TEMP_SENSOR_3.1 UNLIMITED_POWER.1 ; also sheet 1,2,3,4,5,6,7,8,11
5V: LIDAR.2 PERIMETER_WIRE.1 U10.4 UNLIMITED_POWER.2 ; also sheet 1,2,5,11
BATT_POS: UNLIMITED_POWER.3 ; also sheet 1,7,8,9,11
BLADE_MOTOR_NEG_EXT: MAIN_MOTOR.3 MAIN_MOTOR.4 ; also sheet 8
BLADE_MOTOR_POS_EXT: MAIN_MOTOR.1 MAIN_MOTOR.2 ; also sheet 8
GND: C63.1 C64.1 C65.1 C66.1 D2.C GPS.2 LIDAR.1 LIGHT_SENSOR.2 LIMIT_SWITCH_DOWN.3 LIMIT_SWITCH_UP.3 NMOS1.1(S) NMOS1.2(S) NMOS1.3(S) PERIMETER_WIRE.3 PERIMETER_WIRE.4 R54.2 R109.1 R110.1 RAIN_SENSOR.2 TEMP_SENSOR_0.3 TEMP_SENSOR_1.3 TEMP_SENSOR_2.3 TEMP_SENSOR_3.3 U10.2 UNLIMITED_POWER.4 UNLIMITED_POWER.5 ; also sheet 1,2,3,4,5,6,7,8,9
GPS_PPS: GPS.5
GPS_RXD: GPS.4 ; also sheet 4,11
GPS_TXD: GPS.3 ; also sheet 4,11
LIDAR_RX: LIDAR.4 ; also sheet 4,11
LIDAR_TX: LIDAR.7 ; also sheet 4,11
LIMIT_SWITCH_BOTTOM: R108.1 ; also sheet 3
LIMIT_SWITCH_UPPER: R107.1 ; also sheet 3
MCU_0_LIGHT_SENSOR: R66.1 ; also sheet 2
MCU_0_RAIN_SENSOR: R57.1 ; also sheet 2
MCU_0_TEMP_SENSOR_0: R69.1 TEMP_SENSOR_0.2 ; also sheet 2
MCU_0_TEMP_SENSOR_1: R70.1 TEMP_SENSOR_1.2 ; also sheet 2
MCU_0_TEMP_SENSOR_2: R71.1 TEMP_SENSOR_2.2 ; also sheet 2
MCU_0_TEMP_SENSOR_3: R72.1 TEMP_SENSOR_3.2 ; also sheet 2
MCU_2_LIDAR_ENABLE: R62.1 ; also sheet 4
MCU_3_UART2_RX: NAVIGATION_UART.1 ; also sheet 4,5
MCU_3_UART2_TX: NAVIGATION_UART.2 ; also sheet 4,5
N$29: PERIMETER_WIRE.2 R4.2
N$31: LIDAR.5 NMOS1.5(D) NMOS1.6(D) NMOS1.7(D) NMOS1.8(D) NMOS1.TH
N$60: LIGHT_SENSOR.1 R64.2 R66.2
N$74: NMOS1.4(G) R54.1 U10.3
N$82: R55.2 R57.2 RAIN_SENSOR.1
N$86: R62.2 U10.1
N$109: LIMIT_SWITCH_DOWN.2 R108.2 R109.2
N$110: LIMIT_SWITCH_UP.2 R107.2 R110.2
PERIMETER_WIRE_SENSE: D2.A R4.1 ; also sheet 4,11
STEP_DRV_0_A1: STEPPER_0.1 ; also sheet 8
STEP_DRV_0_A2: STEPPER_0.2 ; also sheet 8
STEP_DRV_0_B1: STEPPER_0.3 ; also sheet 8
STEP_DRV_0_B2: STEPPER_0.4 ; also sheet 8
STEP_DRV_1_A1: STEPPER_1.1 ; also sheet 8
STEP_DRV_1_A2: STEPPER_1.2 ; also sheet 8
STEP_DRV_1_B1: STEPPER_1.3 ; also sheet 8
STEP_DRV_1_B2: STEPPER_1.4 ; also sheet 8
STEP_DRV_2_A1: STEPPER_2.1 ; also sheet 8
STEP_DRV_2_A2: STEPPER_2.2 ; also sheet 8
STEP_DRV_2_B1: STEPPER_2.3 ; also sheet 8
STEP_DRV_2_B2: STEPPER_2.4 ; also sheet 8
Unconnected: LIDAR.3 LIDAR.6 LIDAR.8

### Notes on the sheet
- Resistance is between 10M (dark) to less than 100k (daylight)
- Blade motor | Stepper_0 | Stepper_1 | Stepper_2
- Light sensor
- GPS
- Resistance is between 10M (dry) to less than 1M (fully wet)
- Perimeter wire sense
- Lidar
- GPS TXD to MCU RX!
- Rain sensor
- Mechanical limit switches
- Magnetic limit switches
- Temperature sensor DHT11
- Pinheaders

## Sheet 11 of 11: Misc
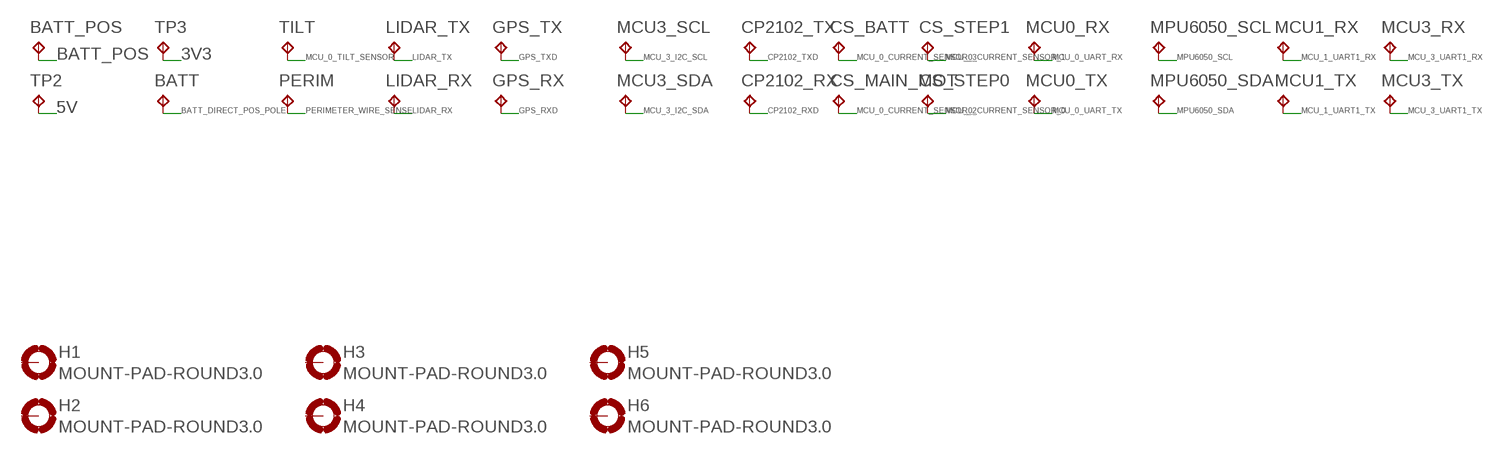
[diagram p10: schematic, sheet 11]

### Parts
BATT  TPB1,27  [B1,27]
BATT_POS  TPB1,27  [B1,27]
CP2102_RX  TPB1,27  [B1,27]
CP2102_TX  TPB1,27  [B1,27]
CS_BATT  TPB1,27  [B1,27]
CS_MAIN_MOT  TPB1,27  [B1,27]
CS_STEP0  TPB1,27  [B1,27]
CS_STEP1  TPB1,27  [B1,27]
GPS_RX  TPB1,27  [B1,27]
GPS_TX  TPB1,27  [B1,27]
H1  MOUNT-PAD-ROUND3.0  [3,0-PAD]
H2  MOUNT-PAD-ROUND3.0  [3,0-PAD]
H3  MOUNT-PAD-ROUND3.0  [3,0-PAD]
H4  MOUNT-PAD-ROUND3.0  [3,0-PAD]
H5  MOUNT-PAD-ROUND3.0  [3,0-PAD]
H6  MOUNT-PAD-ROUND3.0  [3,0-PAD]
LIDAR_RX  TPB1,27  [B1,27]
LIDAR_TX  TPB1,27  [B1,27]
MCU0_RX  TPB1,27  [B1,27]
MCU0_TX  TPB1,27  [B1,27]
MCU1_RX  TPB1,27  [B1,27]
MCU1_TX  TPB1,27  [B1,27]
MCU3_RX  TPB1,27  [B1,27]
MCU3_SCL  TPB1,27  [B1,27]
MCU3_SDA  TPB1,27  [B1,27]
MCU3_TX  TPB1,27  [B1,27]
MPU6050_SCL  TPB1,27  [B1,27]
MPU6050_SDA  TPB1,27  [B1,27]
PERIM  TPB1,27  [B1,27]
TILT  TPB1,27  [B1,27]
TP2  TPB1,27  [B1,27]
TP3  TPB1,27  [B1,27]

### Nets
3V3: TP3.TP ; also sheet 1,2,3,4,5,6,7,8,10
5V: TP2.TP ; also sheet 1,2,5,10
BATT_DIRECT_POS_POLE: BATT.TP ; also sheet 1
BATT_POS: BATT_POS.TP ; also sheet 1,7,8,9,10
CP2102_RXD: CP2102_RX.TP ; also sheet 5,6
CP2102_TXD: CP2102_TX.TP ; also sheet 5,6
GPS_RXD: GPS_RX.TP ; also sheet 4,10
GPS_TXD: GPS_TX.TP ; also sheet 4,10
LIDAR_RX: LIDAR_RX.TP ; also sheet 4,10
LIDAR_TX: LIDAR_TX.TP ; also sheet 4,10
MCU_0_CURRENT_SENSOR_0: CS_STEP0.TP ; also sheet 2,7
MCU_0_CURRENT_SENSOR_1: CS_STEP1.TP ; also sheet 2,7
MCU_0_CURRENT_SENSOR_2: CS_MAIN_MOT.TP ; also sheet 2,7
MCU_0_CURRENT_SENSOR_3: CS_BATT.TP ; also sheet 2,7
MCU_0_TILT_SENSOR: TILT.TP ; also sheet 2
MCU_0_UART_RX: MCU0_RX.TP ; also sheet 2,4
MCU_0_UART_TX: MCU0_TX.TP ; also sheet 2,4
MCU_1_UART1_RX: MCU1_RX.TP ; also sheet 3
MCU_1_UART1_TX: MCU1_TX.TP ; also sheet 3
MCU_3_I2C_SCL: MCU3_SCL.TP ; also sheet 5
MCU_3_I2C_SDA: MCU3_SDA.TP ; also sheet 5
MCU_3_UART1_RX: MCU3_RX.TP ; also sheet 3,5
MCU_3_UART1_TX: MCU3_TX.TP ; also sheet 3,5
MPU6050_SCL: MPU6050_SCL.TP ; also sheet 4,6
MPU6050_SDA: MPU6050_SDA.TP ; also sheet 4,6
PERIMETER_WIRE_SENSE: PERIM.TP ; also sheet 4,10
Unconnected: H1.B3,0(MOUNT) H2.B3,0(MOUNT) H3.B3,0(MOUNT) H4.B3,0(MOUNT) H5.B3,0(MOUNT) H6.B3,0(MOUNT)

## Power pins joined to a net without a drawn wire
EP: U5.25(EP)
VBUS: U15.34(VBUS)

## Library data of the parts
3V3_REG0 3V3_REG1-3V3_REG3 5V_REG0 5V_REG1 = skorra:TSR_1-2433E: Check availability <https://pricing.snapeda.com/parts/TSR%201-2433E/Traco%20Power/view-part?ref=eda>; AVAILABILITY: In Stock; DESCRIPTION: 1 Amp POL converter, industrial, 6-36 VDC input, pos.-pos. circuit, cost efficient, LM78 compatible, SIP-3; MF: Traco Power; MP: TSR 1-2433E; PACKAGE: NON-STANDARD-3 Traco Power; PRICE: None; PURCHASE-URL: https://pricing.snapeda.com/search/part/TSR 1-2433E/?ref=eda
BATT BATT_POS CP2102_RX CP2102_TX CS_BATT CS_MAIN_MOT CS_STEP0 CS_STEP1 GPS_RX GPS_TX LIDAR_RX LIDAR_TX MCU0_RX MCU0_TX MCU1_RX MCU1_TX MCU3_RX MCU3_SCL MCU3_SDA MCU3_TX MPU6050_SCL MPU6050_SDA PERIM TILT TP2 TP3 = testpad:TP: Test pad
BATT1 = mike:SMTU2032LF: Battery holder for CR2032
BATTERY_INPUT EXTERNAL_INPUT = XT60-M:XT60-M: DC supply; XT60; male; PIN:2; for cable; soldered; 60A; 500V Check availability <https://pricing.snapeda.com/parts/XT60-M/AMASS/view-part?ref=eda>; AVAILABILITY: In Stock; DESCRIPTION: Plug; DC supply; XT60; male; PIN: 2; for cable; soldered; 30A; 500V; MF: AMASS; MP: XT60-M; PACKAGE: Package; PRICE: None
BOOT EN = SparkFun-Switches:MOMENTARY-SWITCH-SPST: Momentary Switch (Pushbutton) - SPST Normally-open (NO) SPST momentary switches (buttons, pushbuttons). Variants PTH-12MM - 12mm square, through-hole Momentary Pushbutton Switch - 12mm Square <https://www.sparkfun.com/products/9190> (COM-09190) PTH-6.0MM, PTH-6.0MM-KIT - 6.0mm square, through-hole Mini Pushbutton Switch <https://www.sparkfun.com/products/97> (COM-00097) KIT package intended for soldering kit's - only one side of pads' copper is exposed. PTH-RIGHT-ANGLE-KIT - Right-angle, through-hole Right Angle Tactile Button <https://www.sparkfun.com/products/10791> - Used on SparkFun BigTime Watch Kit <https://www.sparkfun.com/products/11734> SMD-12MM - 12mm square, surface-mount Tactile Button - SMD (12mm) <https://www.sparkfun.com/products/12993> (COM-12993) Used on SparkFun PicoBoard <https://www.sparkfun.com/products/11888> SMD-4.5MM - 4.5mm Square Trackball Switch Used on SparkFun Blackberry Trackballer Breakout <https://www.sparkfun.com/products/13169> SMD-4.6MMX2.8MM - 4.60mm x 2.80mm, surface mount Used on SparkFun SAMD21 Mini Breakout <https://www.sparkfun.com/products/13664> SMD-5.2MM, SMD-5.2-REDUNDANT - 5.2mm square, surface-mount Mini Pushbutton Switch - SMD <https://www.sparkfun.com/products/8720> (COM-08720) Used on Arduino Pro Mini <https://www.sparkfun.com/products/11114> REDUNDANT package connects both switch circuits together SMD-6.0X3.5MM - 6.0 x 3.5mm, surface mount Momentary Reset Switch SMD <https://www.sparkfun.com/products/8229> (COM-08229) SMD-6.2MM-TALL - 6.2mm square, surface mount Tactile Button - SMD (6mm) <https://www.sparkfun.com/products/12992> Used on SparkFun Digital Sandbox <https://www.sparkfun.com/products/12651> SMD-RIGHT-ANGLE - Right-angle, surface mount Used on SparkFun Block for Intel® Edison - Arduino <https://www.sparkfun.com/products/13036>; PROD_ID: SWCH-08441; SF_SKU: COM-00097
BUTTONS = pinhead:PINHD-1X10: PIN HEADER
BUZZER = SparkFun-Electromechanical:BUZZER: Buzzer Small round buzzers that operate around the audible 2kHz range. You can use these as speakers to create simple music or user interfaces. Variant Overview: PTH - Mini Speaker - PC Mount 12mm 2.048kHz <https://www.sparkfun.com/products/7950> PTH_KIT - Mini Speaker - PC Mount 12mm 2.048kHz <https://www.sparkfun.com/products/7950> KIT simplifies soldering by adding stop mask to one side of the pads. PTH_NO_SILK - Mini Speaker - PC Mount 12mm 2.048kHz <https://www.sparkfun.com/products/7950> No silkscreen indicator of buzzer outline. PTH_KIT_NO_SILK - Mini Speaker - PC Mount 12mm 2.048kHz <https://www.sparkfun.com/products/7950> KIT package w/o silkscreen SMD - Buzzer Audio Magnetic (CCV-084B16) SMD buzzer used on, e.g. the LilyPad Buzzer <https://www.sparkfun.com/products/8463> and RFID USB Reader <https://www.sparkfun.com/products/9963>. SMD_KIT - Buzzer Audio Magnetic (CCV-084B16) SMD Buzzer with elongated pins to make soldering easier. Used on the SparkFun Simon Says - Surface Mount Soldering Kit <https://www.sparkfun.com/products/10935>.; PROD_ID: COMP-08253; SF_SKU: COM-07950
C1 C4-C9 C11-C15 C19 C20 C24-C36 C41-C62 C68-C71 C73-C79 C84-C87 = rcl:C-EU: CAPACITOR, European symbol; SPICEPREFIX: C
C2 C3 C72 C80 = rcl:CPOL-EU: POLARIZED CAPACITOR, European symbol; SPICEPREFIX: C
C10 C18 C21-C23 C67 C81 C82 = rcl:C-EU: CAPACITOR, European symbol
C37-C40 C63-C66 = rcl@1:C-EU: CAPACITOR, European symbol; SPICEPREFIX: C
CAMERA CUTOFF_SWITCH DISPLAY MAIN_MOTOR MAIN_SWITCH PERIMETER_WIRE RGB_LED STEPPER_0 STEPPER_1 STEPPER_2 = pinhead:PINHD-1X4: PIN HEADER
CP2102 = silabs:CP210*: Single-Chip USB to UART Bridge Source: www.silabs.com .. CP2101.pdf / cp2102.pdf; MF: FARNELL; MPN: CP2102-GM; OC_FARNELL: 9282130; OC_NEWARK: 30K5635
CURRENT_SENSOR_BATT MAIN_MOTOR_CS STEPPER_0_CS STEPPER_1_CS = TLI4971A050T5UE0001XUMA1:TLI4971A050T5UE0001XUMA1: Current Sensor 50A 1 Channel Hall Effect, Open Loop Unidirectional 8-PowerTDFN Check availability <https://pricing.snapeda.com/parts/TLI4971A050T5UE0001XUMA1/Infineon%20Technologies/view-part?ref=eda>; AVAILABILITY: In Stock; DESCRIPTION: Current Sensor 50A 1 Channel Hall Effect, Open Loop Unidirectional 8-PowerTDFN; MF: Infineon Technologies; MP: TLI4971A050T5UE0001XUMA1; PACKAGE: PowerTDFN-8 Infineon Technologies; PRICE: None; PURCHASE-URL: https://pricing.snapeda.com/search/part/TLI4971A050T5UE0001XUMA1/?ref=eda
D2 = diode:ZENER-DIODE: Z-Diode
D3-D5 = diode:BAT60J: Schottky barrier diode Source: www.st.com, BAT60J.pdf
D6 = SparkFun-DiscreteSemi:DIODE-ZENER: Zener Diode A Zener diode allows current to flow from its anode to its cathode like a normal semiconductor diode, but it also permits current to flow in the reverse direction when its "Zener voltage" is reached. - WIkipedia; PROD_ID: DIO-08199; VALUE: 3.6V
D9-D11 = adafruit:SCHOTTKY-DIODE: Schottky Diode
EM_LIGHT FAN_0 FAN_1-FAN_3 LIGHT_SENSOR NAVIGATION_UART RAIN_SENSOR TILT_SENSOR = pinhead:PINHD-1X2: PIN HEADER
GPS UNLIMITED_POWER = pinhead:PINHD-1X5: PIN HEADER
H1-H6 = holes:MOUNT-PAD-ROUND: MOUNTING PAD, round
IC1 = skorra:PIC24FJ32GA002-X
L1 = 7443641500:7443641500: Wurth WE-HCF Series Shielded Wire-wound SMD Inductor with a MnZn Core, 15 uH +/-15% 30A Idc Source: Datasheet <http://katalog.we-online.com/pbs/datasheet/7443641500.pdf>; DESCRIPTION: Wurth WE-HCF Series Shielded Wire-wound SMD Inductor with a MnZn Core, 15 uH +/-15% 30A Idc; HEIGHT: 15mm; MANUFACTURER_NAME: Wurth Elektronik; MANUFACTURER_PART_NUMBER: 7443641500; MOUSER_PART_NUMBER: 710-7443641500; MOUSER_PRICE-STOCK: https://www.mouser.co.uk/ProductDetail/Wurth-Elektronik/7443641500?qs=Zt3UNFD9mQgHteqNok2K9A%3D%3D
L3 = rcl:L-EU: INDUCTOR, European symbol
LED1-LED5 LED7 LED8 LED12-LED27 = led:LED: LED OSRAM: - CHIPLED LG R971, LG N971, LY N971, LG Q971, LY Q971, LO R971, LY R971 LH N974, LH R974 LS Q976, LO Q976, LY Q976 LO Q996 - Hyper CHIPLED LW Q18S LB Q993, LB Q99A, LB R99A - SideLED LS A670, LO A670, LY A670, LG A670, LP A670 LB A673, LV A673, LT A673, LW A673 LH A674 LY A675 LS A676, LA A676, LO A676, LY A676, LW A676 LS A679, LY A679, LG A679 - Hyper Micro SIDELED® LS Y876, LA Y876, LO Y876, LY Y876 LT Y87S - SmartLED LW L88C, LW L88S LB L89C, LB L89S, LG L890 LS L89K, LO L89K, LY L89K LS L896, LA L896, LO L896, LY L896 - TOPLED LS T670, LO T670, LY T670, LG T670, LP T670 LSG T670, LSP T670, LSY T670, LOP T670, LYG T670 LG T671, LOG T671, LSG T671 LB T673, LV T673, LT T673, LW T673 LH T674 LS T676, LA T676, LO T676, LY T676, LB T676, LH T676, LSB T676, LW T676 LB T67C, LV T67C, LT T67C, LS T67K, LO T67K, LY T67K, LW E67C LS E67B, LA E67B, LO E67B, LY E67B, LB E67C, LV E67C, LT E67C LW T67C LS T679, LY T679, LG T679 LS T770, LO T770, LY T770, LG T770, LP T770 LB T773, LV T773, LT T773, LW T773 LH T774 LS E675, LA E675, LY E675, LS T675 LS T776, LA T776, LO T776, LY T776, LB T776 LHGB T686 LT T68C, LB T68C - Hyper Mini TOPLED® LB M676 - Mini TOPLED Santana® LG M470 LS M47K, LO M47K, LY M47K Source: http://www.osram.convergy.de LUXEON: - LUMILED® LXK2-PW12-R00, LXK2-PW12-S00, LXK2-PW14-U00, LXK2-PW14-V00 LXK2-PM12-R00, LXK2-PM12-S00, LXK2-PM14-U00 LXK2-PE12-Q00, LXK2-PE12-R00, LXK2-PE12-S00, LXK2-PE14-T00, LXK2-PE14-U00 LXK2-PB12-K00, LXK2-PB12-L00, LXK2-PB12-M00, LXK2-PB14-N00, LXK2-PB14-P00, LXK2-PB14-Q00 LXK2-PR12-L00, LXK2-PR12-M00, LXK2-PR14-Q00, LXK2-PR14-R00 LXK2-PD12-Q00, LXK2-PD12-R00, LXK2-PD12-S00 LXK2-PH12-R00, LXK2-PH12-S00 LXK2-PL12-P00, LXK2-PL12-Q00, LXK2-PL12-R00 Source: www.luxeon.com KINGBRIGHT: KA-3528ASYC Source: www.kingbright.com
LIDAR = pinhead:PINHD-1X8: PIN HEADER
LIMIT_SWITCH_DOWN LIMIT_SWITCH_UP MCU_1_UART_RX_SWITCH MCU_1_UART_TX_SWITCH TEMP_SENSOR_0 TEMP_SENSOR_1-TEMP_SENSOR_3 = pinhead:PINHD-1X3: PIN HEADER
MCU_0 MCU_1 MCU_2 = _con-JST-PA:BM05B-PASS
MCU_3_ESP32 = skorra:ESP-32S: Ai-Thinker ESP-32S Check availability <https://pricing.snapeda.com/parts/ESP-32S/Olimex%20LTD/view-part?ref=eda>; AVAILABILITY: Not in stock; DESCRIPTION: - - Transceiver Module - - Surface Mount; MF: Olimex LTD; MP: ESP-32S; PACKAGE: None; PRICE: None
MICROUSB = skorra:MICROUSB: Micro-USB B Receptacle, Mid-Mount, with Through Hole Solder Tab, Gold (Au) Flash Plating, without Mylar, Lead-Free Check availability <https://pricing.snapeda.com/parts/47642-0001/Molex/view-part?ref=eda>; AVAILABILITY: In Stock; DESCRIPTION: USB - micro B - Receptacle Connector 5 Position Board Edge, Cutout; Surface Mount, Right Angle; MF: Molex; MP: 47642-0001; PACKAGE: None; PRICE: None; PURCHASE-URL: https://pricing.snapeda.com/search/part/47642-0001/?ref=eda
NMOS1-NMOS7 = transistor-power:BSC340N08NS3G: OptiMOS TM 3 Power-Transistor BSC340N08NS3 G Source: Data sheet <http://www.infineon.com/dgdl/BSC340N08NS3G_rev2.4.pdf?folderId=db3a304313b8b5a60113cee8763b02d7&fileId=db3a30431add1d95011ae81c21f2563a>
PPTC = PPTC_0ZCF0075AF2C:0ZCF0075AF2C: PTC Resettable Fuse 0.75A(hold) 1.5A(trip) 60VDC 40A 1.5W 0.3s 0.18Ohm SMD Solder Pad 7.98 X 5.44 X 1.15mm T/R Check availability <https://pricing.snapeda.com/parts/0ZCF0075AF2C/Bel%20Fuse/view-part?ref=eda>; AVAILABILITY: In Stock; DESCRIPTION: 2920 SMT PPTC | 0.75 Ih | 603V; MF: Bel Fuse; MP: 0ZCF0075AF2C; PACKAGE: 2920 Bel Fuse; PRICE: None; PURCHASE-URL: https://pricing.snapeda.com/search/part/0ZCF0075AF2C/?ref=eda
Q1 Q8 = transistor-fet:FDD4141: P-Channel PowerTrench® MOSFET Source: FDD4141.pdf
R1-R48 R51-R55 R57 R61-R97 R107-R121 = rcl:R-EU_: RESISTOR, European symbol; SPICEPREFIX: R
R49 R50 = rcl@1:R-EU_: RESISTOR, European symbol; SPICEPREFIX: R
R98-R106 = rcl:R-EU_: RESISTOR, European symbol
RTCC = skkumc:AB-RTCMC-32.768KHZ-B5ZE-S3-T
SD1-SD3 = skorra:MP6500
T2 = transistor:*-NPN-: NPN Transistror BF959 corrected 2008.03.06
TVS25V = 52101-101-REV-A_v16:SUPRESSOR_TVS-UD-: TVS UNI-DIRECTIONAL
U1 = skorra:PIC18F47J13-I/PT; COPYRIGHT: Copyright (C) 2022 Ultra Librarian. All rights reserved.; MANUFACTURER_PART_NUMBER: pic18f47j13-i/pt; MFR_NAME: Microchip
U4 U6-U13 = Wurth_Optocoupler_WL-OCPT:WL-OCPT_SERIES_357: WL-OCPT SOP-4 Series 357 Characteristics High isolation voltage Good stability of inner isolation Stable CTR in full operation temperature range Different CTR binnings available High Collector-Emitter voltage Fast switching times Applications Power Supply, charger Computers & Microprocessors Office equipment Instrumental applications, machines Ammeter, Smart Meter <https://www.we-online.com/catalog/media/o198228v209%20WL-OCPT_SOP_354_multi-parts.jpg> Details see: www.we-online.de/katalog/WL-OCPT_PACKAGE_SOP-4 <www.we-online.com/catalog/WL-OCPT_PACKAGE_SOP-4/?utm_source=eagle_model&utm_medium=description_link&utm_campaign=eisos_eagle> Updated by Ella Wu, 2022-06-21 2022 (C) Wurth Elektronik; CTR-MAX: 600%; CTR-MIN: 50%; DATASHEET-URL: https://www.we-online.com/redexpert/spec/140357145000?ae; IF: 60mA; MOUNT: SMT; PART-NUMBER: 140357145000; TC-CTR: IF = 5mA,VCE = 5 V; VCE: 35V; VISO: 3750(V(RMS))
U5 = Sensor:MPU-6050: IMU ACCEL/GYRO 3-AXIS I2C 24QFN Manufacturer's datasheet <https://store.invensense.com/datasheets/invensense/MPU-6050_DataSheet_V3%204.pdf>; CREATED_BY: PCBLayout.com; DIGIKEY_PART_NUMBER: 1428-1007-1-ND; MANUFACTURER: TDK InvenSense; MPN: MPU-6050; PACKAGE: 24-VFQFN
U15 = 2022-02-16_10-30-07_Library:PIC32MK1024MCM064-I/PT; COPYRIGHT: Copyright (C) 2022 Ultra Librarian. All rights reserved.; MANUFACTURER_PART_NUMBER: PIC32MK1024MCM064-I/PT; MFR_NAME: Microchip
X5 = con-yamaichi:FPS009-300*: SD Card and MMC Reader (Manual Insertion) Source: http://www.yamaichi.de/pdf/c_fps009_3000.pdf; OC_FARNELL: unknown; OC_NEWARK: unknown